# Altium project Outdoor_Tracking.PrjPcb (part 1 of 2)
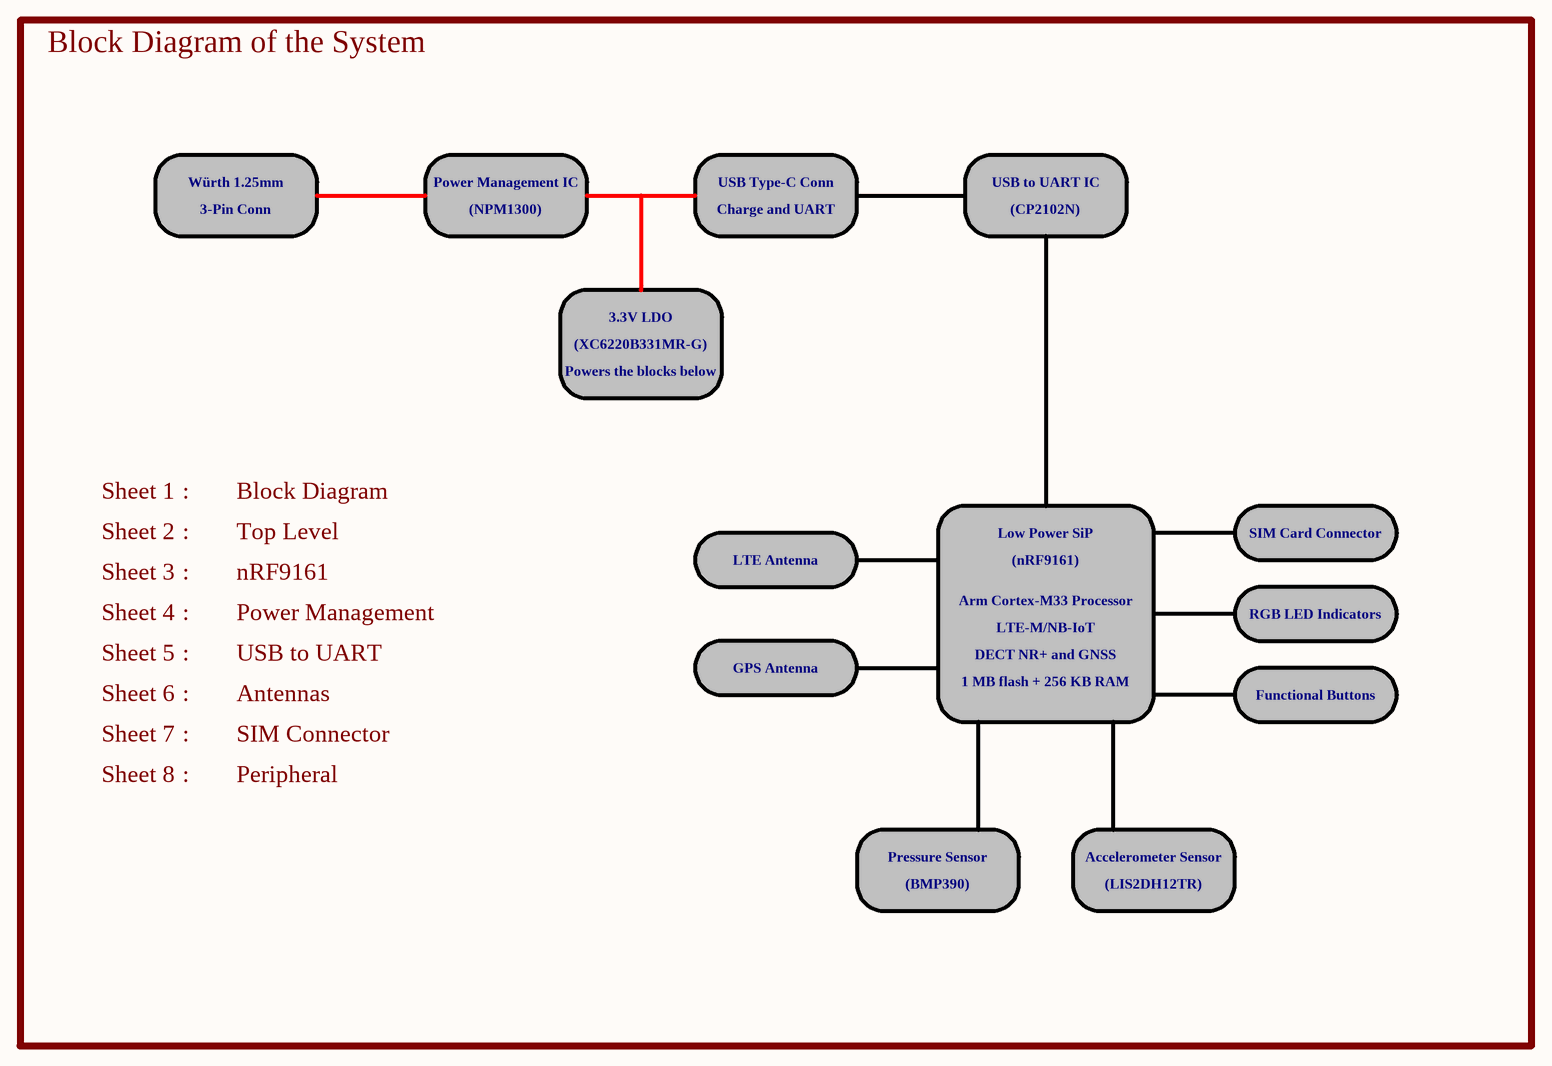
[diagram p0: Block Diagram.SchDoc]
8 sheets, 134 parts. Net scope: hierarchical (ports join the sheet entries above them; power ports are global).
Board file: Outdoor_Tracker_v1.0.PcbDoc
Sheets:
  Block Diagram.SchDoc
  MAIN.SchDoc
    U_nRF9161 = nRF9161.SchDoc
    U_Power_Management = Power_Management.SchDoc
    U_USB_to_UART = USB_to_UART.SchDoc
    U_Peripheral = Peripheral.SchDoc
    U_Antennas = Antennas.SchDoc
    U_SIM_Connector = SIM_Connector.SchDoc

## Sheet Block Diagram.SchDoc
size A3; ApprovedBy: Mustafa Atılay Beycan; CheckedBy: Mustafa Atılay Beycan; Author: Mustafa Atılay Beycan; CompanyName: Mustafa Atılay Beycan; DrawnBy: Mustafa Atılay Beycan; Engineer: Mustafa Atılay Beycan; Organization: Mustafa Atılay Beycan; SheetNumber: 1; SheetTotal: 8; FilePath: https://github.com/mustafaatilay/Outdoor-Tracking-Project

### Notes on the sheet
- Block Diagram of the System
- Würth 1.25mm
- 3-Pin Conn
- Power Management IC
- (NPM1300)
- USB Type-C Conn
- Charge and UART
- USB to UART IC
- (CP2102N)
- 3.3V LDO
- (XC6220B331MR-G)
- Powers the blocks below
- Sheet 1
- Sheet 2
- :
- Block Diagram
- Top Level
- Low Power SiP
- SIM Card Connector
- Sheet 3
- nRF9161
- LTE Antenna
- (nRF9161)
- Arm Cortex-M33 Processor
- RGB LED Indicators
- Sheet 4
- Sheet 5
- Power Management
- USB to UART
- GPS Antenna
- LTE-M/NB-IoT
- DECT NR+ and GNSS
- 1 MB flash + 256 KB RAM
- Sheet 6
- Sheet 7
- Antennas
- SIM Connector
- Functional Buttons
- Sheet 8
- Peripheral
- Pressure Sensor
- (BMP390)
- Accelerometer Sensor
- (LIS2DH12TR)
- Project Name
- Designed by
- Schematic Name
- Checked by
- Page Size
- File Path
- Modified Date
- Revision No
- Sheet
- of
- A3

## Sheet MAIN.SchDoc
size A3; ApprovedBy: Mustafa Atılay Beycan; CheckedBy: Mustafa Atılay Beycan; Author: Mustafa Atılay Beycan; CompanyName: Mustafa Atılay Beycan; DrawnBy: Mustafa Atılay Beycan; Engineer: Mustafa Atılay Beycan; Organization: Mustafa Atılay Beycan; SheetNumber: 2; SheetTotal: 8; FilePath: https://github.com/mustafaatilay/Outdoor-Tracking-Project
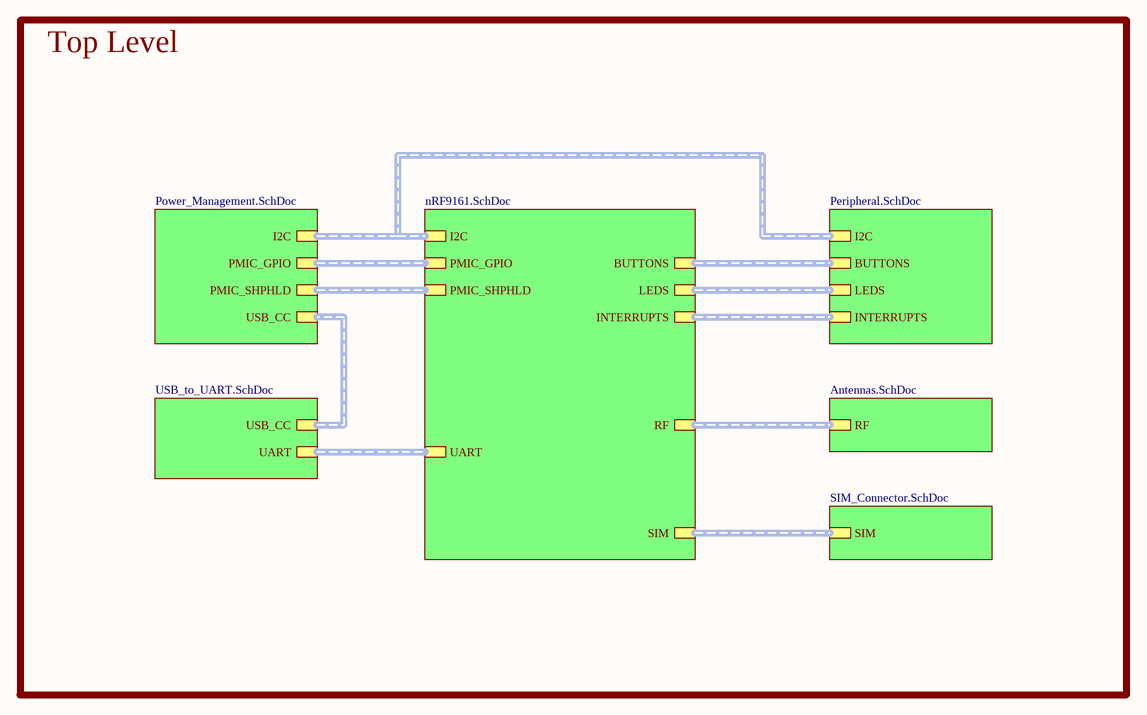
[diagram p1: MAIN.SchDoc]

### Sub-sheets
U_Antennas = Antennas.SchDoc: RF (harness RF)
U_nRF9161 = nRF9161.SchDoc: I2C (harness I2C), BUTTONS (harness BUTTONS), LEDS (harness LEDS), INTERRUPTS (harness INTERRUPTS), SIM (harness SIM), RF (harness RF), UART (harness UART), PMIC_GPIO (harness PMIC_GPIO), PMIC_SHPHLD (harness PMIC_SHPHLD)
U_Peripheral = Peripheral.SchDoc: I2C (harness I2C), BUTTONS (harness BUTTONS), LEDS (harness LEDS), INTERRUPTS (harness INTERRUPTS)
U_Power_Management = Power_Management.SchDoc: I2C (harness I2C), PMIC_GPIO (harness PMIC_GPIO), USB_CC (harness USB_CC), PMIC_SHPHLD (harness PMIC_SHPHLD)
U_SIM_Connector = SIM_Connector.SchDoc: SIM (harness SIM)
U_USB_to_UART = USB_to_UART.SchDoc: UART (harness UART), USB_CC (harness USB_CC)

### Buses and harness runs
harness sheet U_Antennas/RF = sheet U_nRF9161/RF
harness sheet U_nRF9161/BUTTONS = sheet U_Peripheral/BUTTONS
harness sheet U_nRF9161/I2C = sheet U_Peripheral/I2C = sheet U_Power_Management/I2C
harness sheet U_nRF9161/INTERRUPTS = sheet U_Peripheral/INTERRUPTS
harness sheet U_nRF9161/LEDS = sheet U_Peripheral/LEDS
harness sheet U_nRF9161/PMIC_GPIO = sheet U_Power_Management/PMIC_GPIO
harness sheet U_nRF9161/PMIC_SHPHLD = sheet U_Power_Management/PMIC_SHPHLD
harness sheet U_nRF9161/SIM = sheet U_SIM_Connector/SIM
harness sheet U_nRF9161/UART = sheet U_USB_to_UART/UART
harness sheet U_Power_Management/USB_CC = sheet U_USB_to_UART/USB_CC

### Notes on the sheet
- Top Level
- Project Name
- Designed by
- Schematic Name
- Checked by
- Page Size
- File Path
- Modified Date
- Revision No
- Sheet
- of
- A3

## Sheet nRF9161.SchDoc
size A3; ApprovedBy: Mustafa Atılay Beycan; CheckedBy: Mustafa Atılay Beycan; Author: Mustafa Atılay Beycan; CompanyName: Mustafa Atılay Beycan; DrawnBy: Mustafa Atılay Beycan; Engineer: Mustafa Atılay Beycan; Organization: Mustafa Atılay Beycan; SheetNumber: 3; SheetTotal: 8; FilePath: https://github.com/mustafaatilay/Outdoor-Tracking-Project
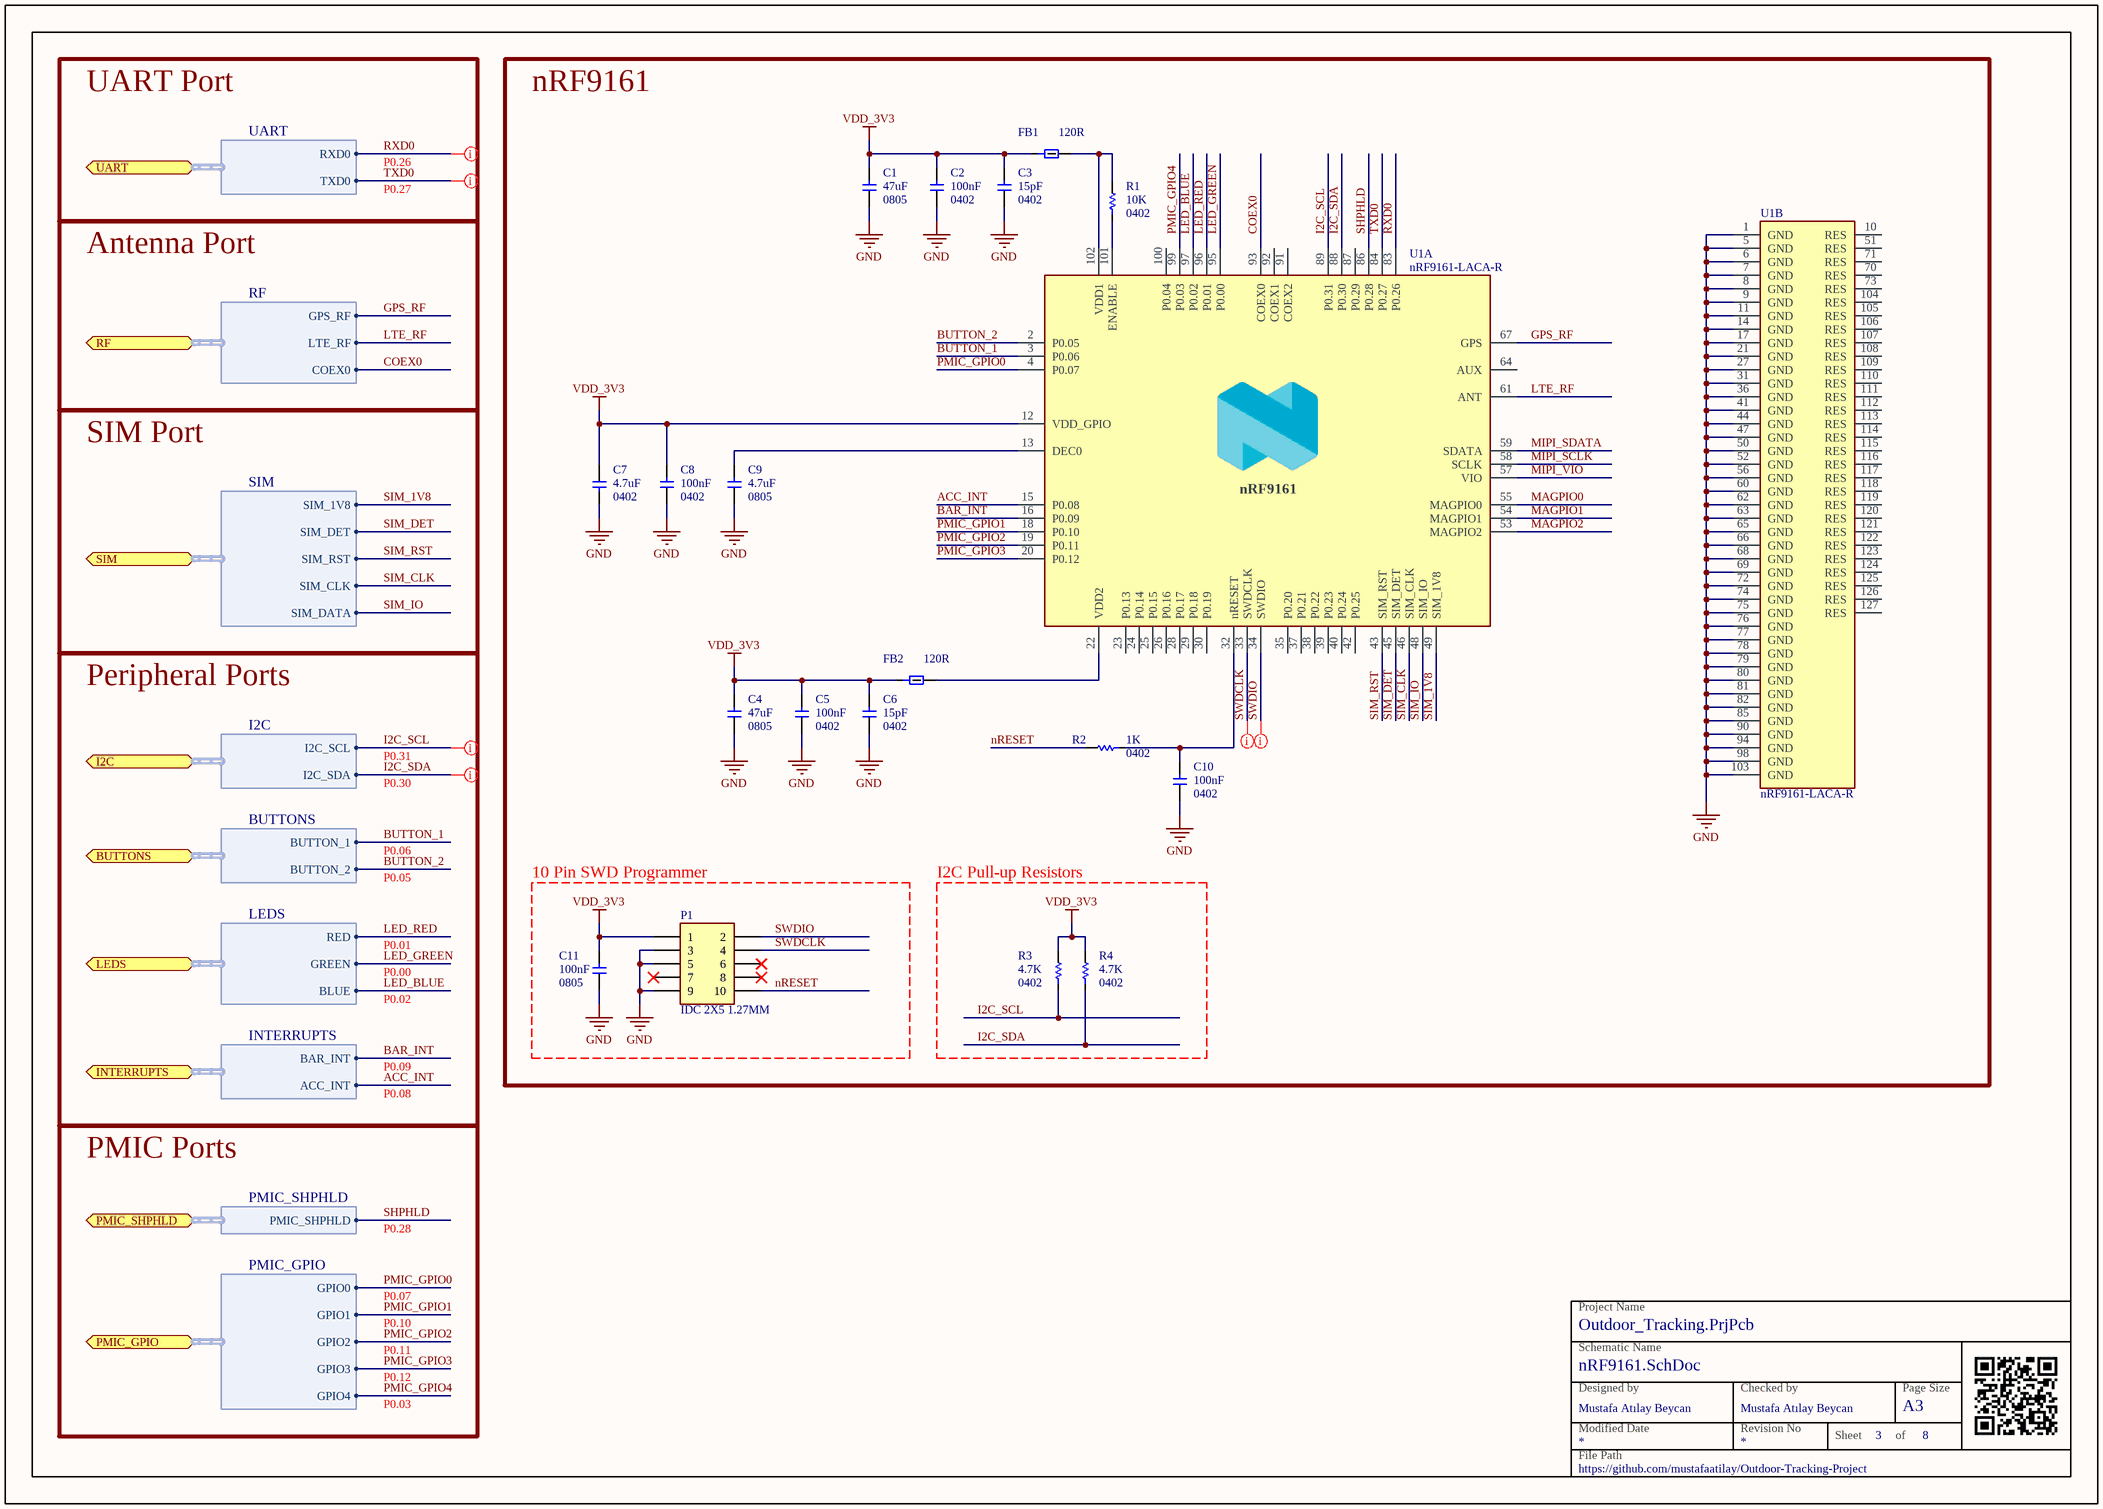
[diagram p2: nRF9161.SchDoc]

### Parts
C1  Capacitance: 47uF  Package: 0805  [CAP 0805]  (hidden comment: 47uF 10% X7R 10V 0805 SMD)
C2  Capacitance: 100nF  Package: 0402  [CAP 0402]  (hidden comment: 100nF 10% X7R 10V 0402 SMD)
C3  Capacitance: 15pF  Package: 0402  [CAP 0402]  (hidden comment: 15pF 10% X7R 16V 0402 SMD)
C4  Capacitance: 47uF  Package: 0805  [CAP 0805]  (hidden comment: 47uF 10% X7R 10V 0805 SMD)
C5  Capacitance: 100nF  Package: 0402  [CAP 0402]  (hidden comment: 100nF 10% X7R 10V 0402 SMD)
C6  Capacitance: 15pF  Package: 0402  [CAP 0402]  (hidden comment: 15pF 10% X7R 16V 0402 SMD)
C7  Capacitance: 4.7uF  Package: 0402  [CAP 0402]  (hidden comment: 4.7uF 10% X7R 10V 0402 SMD)
C8  Capacitance: 100nF  Package: 0402  [CAP 0402]  (hidden comment: 100nF 10% X7R 10V 0402 SMD)
C9  Capacitance: 4.7uF  Package: 0805  [CAP 0805]  (hidden comment: 4.7uF 10% X7R 10V 0805 SMD)
C10  Capacitance: 100nF  Package: 0402  [CAP 0402]  (hidden comment: 100nF 10% X7R 16V 0402 SMD)
C11  Capacitance: 100nF  Package: 0805  [CAP 0805]  (hidden comment: 100nF 10% X7R 16V 0805 SMD)
FB1  Impedance: 120R  [FERRITE 0402]  (hidden comment: BLM15AX121SN1D)
FB2  Impedance: 120R  [FERRITE 0402]  (hidden comment: BLM15AX121SN1D)
P1  IDC 2X5 1.27MM  [CONN 2x5 IDC 1.27MM]
R1  Resistance: 10K  Package: 0402  [RES 0402]  (hidden comment: 10K 1% 1/10W 0402 SMD)
R2  Resistance: 1K  Package: 0402  [RES 0402]  (hidden comment: 1K 5% 1/10W 0402 SMD)
R3  Resistance: 4.7K  Package: 0402  [RES 0402]  (hidden comment: 4.7K 5% 1/10W 0402 SMD)
R4  Resistance: 4.7K  Package: 0402  [RES 0402]  (hidden comment: 4.7K 5% 1/10W 0402 SMD)
U1  nRF9161-LACA-R  [IC nRF9161]  (parts A,B of 2)

### Blocks framed on the sheet
nRF9161: C1-C10 FB1 FB2 R1 R2 U1
10 Pin SWD Programmer: C11 P1
I2C Pull-up Resistors: R3 R4

### Ports
BUTTONS (bidir, harness BUTTONS), I2C (bidir, harness I2C), INTERRUPTS (bidir, harness INTERRUPTS), LEDS (bidir, harness LEDS), PMIC_GPIO (bidir, harness PMIC_GPIO), PMIC_SHPHLD (bidir, harness PMIC_SHPHLD), RF (bidir, harness RF), SIM (bidir, harness SIM), UART (bidir, harness UART)

### Harnesses
PMIC_GPIO: GPIO0, GPIO1, GPIO2, GPIO3, GPIO4
PMIC_SHPHLD: PMIC_SHPHLD
I2C: I2C_SCL, I2C_SDA
BUTTONS: BUTTON_1, BUTTON_2
LEDS: RED, GREEN, BLUE
INTERRUPTS: BAR_INT, ACC_INT
SIM: SIM_1V8, SIM_DET, SIM_RST, SIM_CLK, SIM_DATA
RF: GPS_RF, LTE_RF, COEX0
UART: RXD0, TXD0

### Nets
GND: C1.2 C2.2 C3.2 C4.2 C5.2 C6.2 C7.1 C8.2 C9.2 C10.2 C11.2 P1.3 P1.5 P1.9 U1.1(GND) U1.5(GND) U1.6(GND) U1.7(GND) U1.8(GND) U1.9(GND) U1.11(GND) U1.14(GND) U1.17(GND) U1.21(GND) U1.27(GND) U1.31(GND) U1.36(GND) U1.41(GND) U1.44(GND) U1.47(GND) U1.50(GND) U1.52(GND) U1.56(GND) U1.60(GND) U1.62(GND) U1.63(GND) U1.65(GND) U1.66(GND) U1.68(GND) U1.69(GND) U1.72(GND) U1.74(GND) U1.75(GND) U1.76(GND) U1.77(GND) U1.78(GND) U1.79(GND) U1.80(GND) U1.81(GND) U1.82(GND) U1.85(GND) U1.90(GND) U1.94(GND) U1.98(GND) U1.103(GND)
VDD_3V3: C1.1 C2.1 C3.1 C4.1 C5.1 C6.1 C7.2 C8.1 C11.1 FB1.1 FB2.1 P1.1 R3.2 R4.2 U1.12(VDD_GPIO)
ACC_INT: U1.15(P0.08) ; port INTERRUPTS.ACC_INT
BAR_INT: U1.16(P0.09) ; port INTERRUPTS.BAR_INT
BUTTON_1: U1.3(P0.06) ; port BUTTONS.BUTTON_1
BUTTON_2: U1.2(P0.05) ; port BUTTONS.BUTTON_2
COEX0: U1.93(COEX0) ; port RF.COEX0
GPS_RF: U1.67(GPS) ; port RF.GPS_RF
I2C_SCL: R3.1 U1.89(P0.31) ; port I2C.I2C_SCL
I2C_SDA: R4.1 U1.88(P0.30) ; port I2C.I2C_SDA
LED_BLUE: U1.97(P0.02) ; port LEDS.BLUE
LED_GREEN: U1.95(P0.00) ; port LEDS.GREEN
LED_RED: U1.96(P0.01) ; port LEDS.RED
LTE_RF: U1.61(ANT) ; port RF.LTE_RF
MAGPIO0: U1.55(MAGPIO0)
MAGPIO1: U1.54(MAGPIO1)
MAGPIO2: U1.53(MAGPIO2)
MIPI_SCLK: U1.58(SCLK)
MIPI_SDATA: U1.59(SDATA)
MIPI_VIO: U1.57(VIO)
nRESET: P1.10 R2.2
PMIC_GPIO0: U1.4(P0.07) ; port PMIC_GPIO.GPIO0
PMIC_GPIO1: U1.18(P0.10) ; port PMIC_GPIO.GPIO1
PMIC_GPIO2: U1.19(P0.11) ; port PMIC_GPIO.GPIO2
PMIC_GPIO3: U1.20(P0.12) ; port PMIC_GPIO.GPIO3
PMIC_GPIO4: U1.99(P0.03) ; port PMIC_GPIO.GPIO4
RXD0: U1.83(P0.26) ; port UART.RXD0
SHPHLD: U1.86(P0.28) ; port PMIC_SHPHLD.PMIC_SHPHLD
SIM_1V8: U1.49(SIM_1V8) ; port SIM.SIM_1V8
SIM_CLK: U1.46(SIM_CLK) ; port SIM.SIM_CLK
SIM_DET: U1.45(SIM_DET) ; port SIM.SIM_DET
SIM_IO: U1.48(SIM_IO) ; port SIM.SIM_DATA
SIM_RST: U1.43(SIM_RST) ; port SIM.SIM_RST
SWDCLK: P1.4 U1.33(SWDCLK)
SWDIO: P1.2 U1.34(SWDIO)
TXD0: U1.84(P0.27) ; port UART.TXD0
NetC9_1: C9.1 U1.13(DEC0)
NetC10_1: C10.1 R2.1 U1.32(nRESET)
NetFB1_2: FB1.2 R1.2 U1.102(VDD1)
NetFB2_2: FB2.2 U1.22(VDD2)
NetR1_1: R1.1 U1.101(ENABLE)

Not connected (* = marked no-connect by the designer): P1 6* 7* 8*; U1 10(RES) 23(P0.13) 24(P0.14) 25(P0.15) 26(P0.16) 28(P0.17) 29(P0.18) 30(P0.19) 35(P0.20) 37(P0.21) 38(P0.22) 39(P0.23) 40(P0.24) 42(P0.25) 51(RES) 64(AUX) 70(RES) 71(RES) 73(RES) 87(P0.29) 91(COEX2) 92(COEX1) 100(P0.04) 104(RES) 105(RES) 106(RES) 107(RES) 108(RES) 109(RES) 110(RES) 111(RES) 112(RES) 113(RES) 114(RES) 115(RES) 116(RES) 117(RES) 118(RES) 119(RES) 120(RES) 121(RES) 122(RES) 123(RES) 124(RES) 125(RES) 126(RES) 127(RES)

### Layout directives
net class SWD: SWDCLK, SWDIO
net class UART: RXD0, TXD0
net class I2C: I2C_SCL, I2C_SDA

### Notes on the sheet
- UART Port
- P0.26
- P0.27
- Antenna Port
- SIM Port
- Peripheral Ports
- P0.30
- P0.31
- P0.06
- P0.05
- P0.00
- P0.01
- P0.02
- P0.09
- P0.08
- PMIC Ports
- P0.28
- P0.07
- P0.10
- P0.03
- P0.11
- P0.12
- Project Name
- Designed by
- Schematic Name
- Checked by
- Page Size
- File Path
- Modified Date
- Revision No
- Sheet
- of
- A3
- (in symbol IC nRF9161-LACA-R, part A) nRF9161

### Library data of the parts
C1 C4 = CAP 0805 47uF 10V: ALT MALZEME KODU: 1.009.00956; Link: *; Manufacturer: *; Manufacturer Part Number: *; Value: 47uF 10% X7R 10V 0805 SMD; Tolerance: 10%; TemperatureCoefficient: X7R; Mount: SMD; Voltage: 10V
C2 C5 C8 = CAP 0402 100nF 10V: ALT MALZEME KODU: 1.009.00840; Link: *; Manufacturer: *; Manufacturer Part Number: *; Value: 100nF 10% X7R 10V 0402 SMD; Tolerance: 10%; TemperatureCoefficient: X7R; Mount: SMD; Voltage: 10V
C3 C6 = CAP 0402 15pF 16V: ALT MALZEME KODU: 1.009.00947; Link: *; Manufacturer: *; Manufacturer Part Number: *; Value: 15pF 10% X7R 16V 0402 SMD; Tolerance: 10%; TemperatureCoefficient: X7R; Mount: SMD; Voltage: 16V
C7 = CAP 0402 4.7uF 10V: ALT MALZEME KODU: 1.009.00987; Link: *; Manufacturer: *; Manufacturer Part Number: *; Value: 4.7uF 10% X7R 10V 0402 SMD; Tolerance: 10%; TemperatureCoefficient: X7R; Mount: SMD; Voltage: 10V
C9 = CAP 0805 4.7uF 10V: ALT MALZEME KODU: 1.009.00882; Link: *; Manufacturer: *; Manufacturer Part Number: *; Value: 4.7uF 10% X7R 10V 0805 SMD; Tolerance: 10%; TemperatureCoefficient: X7R; Mount: SMD; Voltage: 10V
C10 = CAP 0402 100nF 16V: ALT MALZEME KODU: 1.009.00275; Link: *; Manufacturer: *; Manufacturer Part Number: *; Value: 100nF 10% X7R 16V 0402 SMD; Tolerance: 10%; TemperatureCoefficient: X7R; Mount: SMD; Voltage: 16V
C11 = CAP 0805 100nF 16V: ALT MALZEME KODU: 1.009.00953; Link: *; Manufacturer: *; Manufacturer Part Number: *; Value: 100nF 10% X7R 16V 0805 SMD; Tolerance: 10%; TemperatureCoefficient: X7R; Mount: SMD; Voltage: 16V
FB1 FB2 = FER BLM15AX121SN1D: FERRITE BEAD 120 OHM 0402 1LN; Manufacturer: Murata; Material: Steel; Core Material: 228ConductorMaterial; Tolerance: 25%; Current Rating: 700mA; Number of Lines: 1; DC Resistance (DCR): 130mR; Test Frequency: 100MHz; ComponentLink1URL: https://datasheet.ciiva.com/18183/getdatasheetpartid-238207-18183177.pdf?src-supplier=Verical; ComponentLink1Description: https://datasheet.ciiva.com/18183/getdatasheetpartid-238207-18183177.pdf?src-supplier=Verical; ComponentLink2URL: https://datasheet.ciiva.com/41449/001172204-da-01-en-drossel-0402-600r-1-0x0-5mm-10000st-41449492.pdf?src-supplier=Conrad; ComponentLink2Description: https://datasheet.ciiva.com/41449/001172204-da-01-en-drossel-0402-600r-1-0x0-5mm-10000st-41449492.pdf?src-supplier=Conrad; ComponentLink3URL: https://datasheet.ciiva.com/41425/001171685-da-01-en-chip-drossel0402-600r-300ma-1-0x0-5mm-41425771.pdf?src-supplier=Conrad; ComponentLink3Description: https://datasheet.ciiva.com/41425/001171685-da-01-en-chip-drossel0402-600r-300ma-1-0x0-5mm-41425771.pdf?src-supplier=Conrad; ComponentLink4URL: https://datasheet.ciiva.com/1014/l0110s0101blm15h-1014466.pdf?src-supplier=Digi-Key; ComponentLink4Description: https://datasheet.ciiva.com/1014/l0110s0101blm15h-1014466.pdf?src-supplier=Digi-Key; ComponentLink5URL: https://datasheet.ciiva.com/1014/l0110s0101blm15h-1014467.pdf?src-supplier=Digi-Key; ComponentLink5Description: https://datasheet.ciiva.com/1014/l0110s0101blm15h-1014467.pdf?src-supplier=Digi-Key; ComponentLink6URL: https://datasheet.ciiva.com/1466/5168-1466917.pdf?src-supplier=Element14; ComponentLink6Description: https://datasheet.ciiva.com/1466/5168-1466917.pdf?src-supplier=Element14; ComponentLink7URL: https://datasheet.ciiva.com/1466/5168-1466918.pdf?src-supplier=Element14; ComponentLink7Description: https://datasheet.ciiva.com/1466/5168-1466918.pdf?src-supplier=Element14; ComponentLink8URL: https://datasheet.ciiva.com/3081/l0110s0101blm15h-3081608.pdf?src-supplier=Avnet; ComponentLink8Description: https://datasheet.ciiva.com/3081/l0110s0101blm15h-3081608.pdf?src-supplier=Avnet; ComponentLink9URL: https://datasheet.ciiva.com/6212/l0110s0101blm15h-6212328.pdf?src-supplier=Digi-Key; ComponentLink9Description: https://datasheet.ciiva.com/6212/l0110s0101blm15h-6212328.pdf?src-supplier=Digi-Key; ComponentLink10URL: https://datasheet.ciiva.com/16204/l0110s0101blm15h-16204027.pdf?src-supplier=Future+Electronics; ComponentLink10Description: https://datasheet.ciiva.com/16204/l0110s0101blm15h-16204027.pdf?src-supplier=Future+Electronics; Link: https://bit.ly/3wIr28H; ALT MALZEME KODU: *; Supplier 1: Mouser; Manufacturer Part Number: BLM15AX121SN1D; RoHS: Yes; Category: Ferrite Beads and Chips; Stock 1: 30042; Pricing 1: 1=0,1, 10=0,051, 50=0,051, 100=0,028, 1000=0,022, 10000=0,015 (USD); Case/Package: 0402; Number of Pins: 2; Case Code (Metric): 1005; Case Code (Imperial): 0402; Weight: 2.3E-05oz; Min Operating Temperature: -55°C; Max Operating Temperature: 125°C; Package Quantity: 1; Packaging: Tape and Reel; Max Current Rating: 700mA; Termination: SMD/SMT; Max DC Current: 700mA; Number of Circuits: 1; Series: BLM15AX_SN; RMS Current (Irms): 700mA; Series Resistance: 130mR; Length: 1mm; Width: 0.5mm; Height: 0.5mm; Reach SVHC Compliant: No; Lead Free: Lead Free; RoHS Compliant: Yes; ComponentLink11URL: https://datasheet.ciiva.com/41449/001172167-da-01-en-drossel-0402-120r-1-0x0-5mm-10000st-41449456.pdf?src-supplier=Conrad; ComponentLink11Description: https://datasheet.ciiva.com/41449/001172167-da-01-en-drossel-0402-120r-1-0x0-5mm-10000st-41449456.pdf?src-supplier=Conrad; ComponentLink12URL: https://datasheet.ciiva.com/1012/l0110e-1012387.pdf?src-supplier=Digikey; ComponentLink12Description: https://datasheet.ciiva.com/1012/l0110e-1012387.pdf?src-supplier=Digikey; ComponentLink13URL: https://datasheet.ciiva.com/1012/l0110e-1012386.pdf?src-supplier=Digikey; ComponentLink13Description: https://datasheet.ciiva.com/1012/l0110e-1012386.pdf?src-supplier=Digikey; ComponentLink14URL: https://datasheet.ciiva.com/1012/l0110e-1012388.pdf?src-supplier=Digikey; ComponentLink14Description: https://datasheet.ciiva.com/1012/l0110e-1012388.pdf?src-supplier=Digikey; Supplier Part Number 1: 81-BLM15AX121SN1D
P1 = HEADER 2 X 5 IDC: CONN HEADER 2 X 5 1.27MM; LatestRevisionDate: 17-Jul-2002; LatestRevisionNote: Re-released for DXP Platform.; Publisher: Altium Limited
R1 = RES 0402 10K 1%: ALT MALZEME KODU: 1.031.00963; Link: *; Manufacturer: *; Manufacturer Part Number: *; Value: 10K 1% 1/10W 0402 SMD; Tolerance: 1%; PowerRating: 1/10W; Mount: SMD
R2 = RES 0402 1K 5%: ALT MALZEME KODU: 1.031.00622; Link: *; Manufacturer: *; Manufacturer Part Number: *; Value: 1K 5% 1/10W 0402 SMD; PowerRating: 1/10W; Mount: SMD; Tolerance: 5%
R3 R4 = RES 0402 4.7K 5%: ALT MALZEME KODU: 1.031.00627; Link: *; Manufacturer: *; Manufacturer Part Number: *; Value: 4.7K 5% 1/10W 0402 SMD; PowerRating: 1/10W; Mount: SMD; Tolerance: 5%
U1 = IC nRF9161-LACA-R: Manufacturer: Nordic Semiconductor ASA; Voltage - Supply: 3V ~ 5.5V; GPIO: 32; Serial Interfaces: I2C, I2S, PWM, SPI, UART; Memory Size: 1MB Flash, 256kB RAM; Sensitivity: -108dBm; Power - Output: 23dBm; Data Rate (Max): 8Mbps; Frequency: 600MHz ~ 2.2GHz; Protocol: GPS; RF Family/Standard: Cellular; Link 2: https://bit.ly/4aFKUH8; Link: https://bit.ly/3X10dqO; Type: TxRx Only; Manufacturer Product Number: NRF9161-LACA-R; Series: NRF9161

## Sheet Power_Management.SchDoc
size A3; ApprovedBy: Mustafa Atılay Beycan; CheckedBy: Mustafa Atılay Beycan; Author: Mustafa Atılay Beycan; CompanyName: Mustafa Atılay Beycan; DrawnBy: Mustafa Atılay Beycan; Engineer: Mustafa Atılay Beycan; Organization: Mustafa Atılay Beycan; SheetNumber: 4; SheetTotal: 8; FilePath: https://github.com/mustafaatilay/Outdoor-Tracking-Project
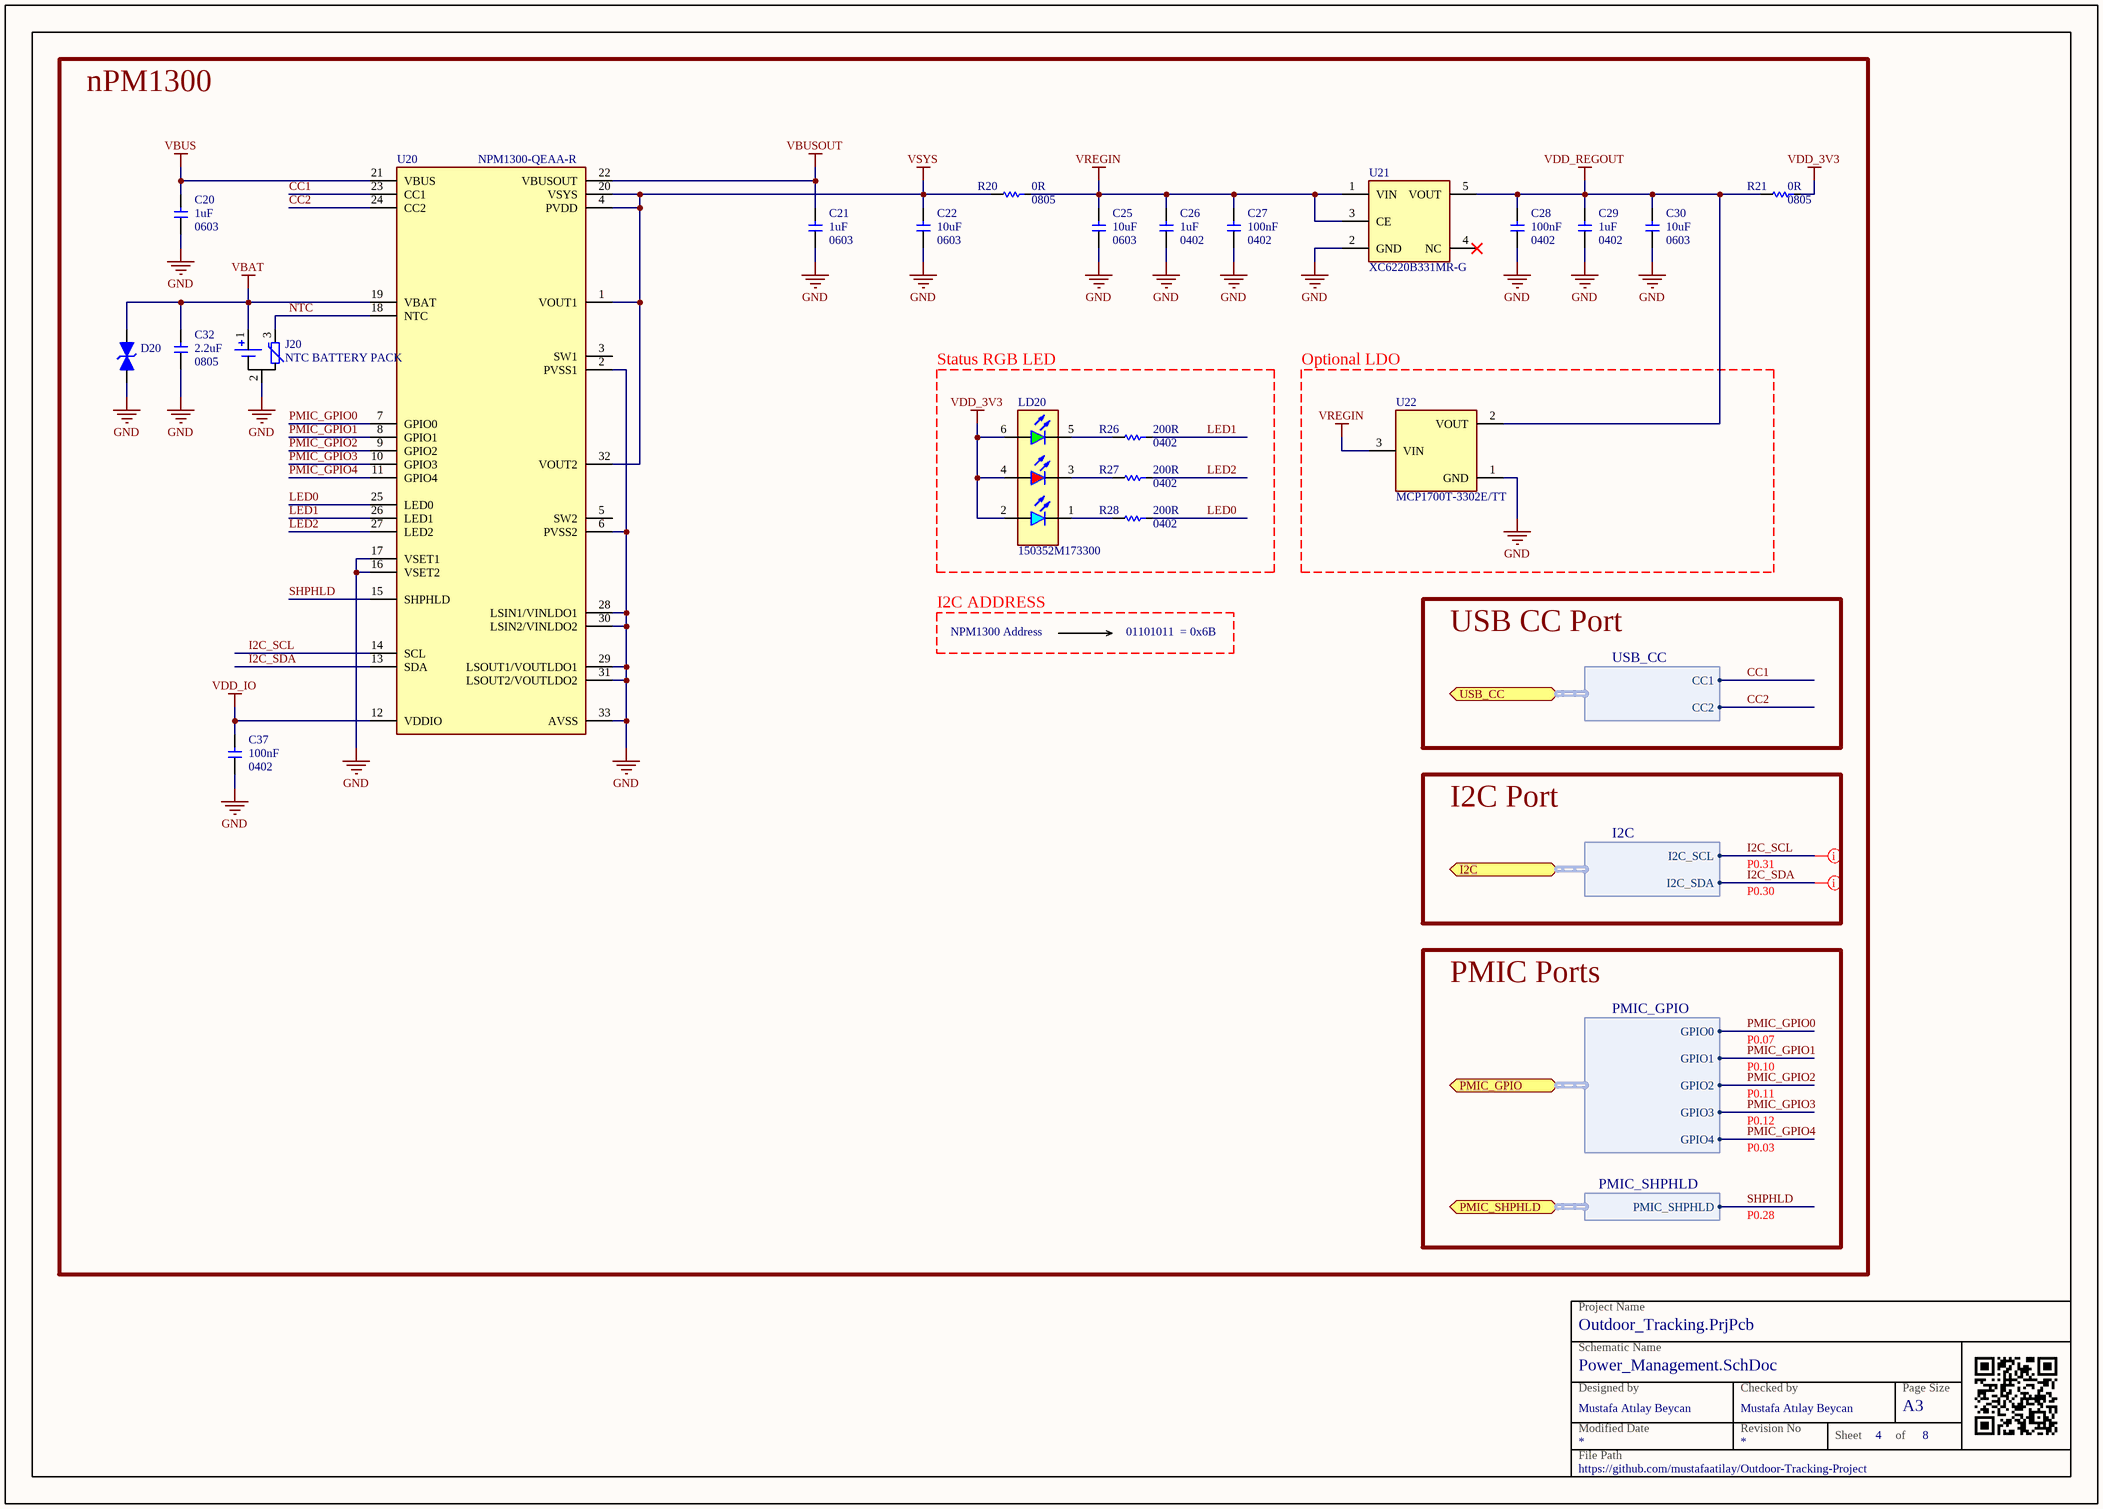
[diagram p3: Power_Management.SchDoc]

### Parts
C20  Capacitance: 1uF  Package: 0603  [CAP 0603]  (hidden comment: 1uF 10% X7R 16V 0603 SMD)
C21  Capacitance: 1uF  Package: 0603  [CAP 0603]  (hidden comment: 1uF 10% X7R 16V 0603 SMD)
C22  Capacitance: 10uF  Package: 0603  [CAP 0603]  (hidden comment: 10uF 20% X5R 25V 0603 SMD)
C25  Capacitance: 10uF  Package: 0603  [CAP 0603]  (hidden comment: 10uF 20% X5R 25V 0603 SMD)
C26  Capacitance: 1uF  Package: 0402  [CAP 0402]  (hidden comment: 1uF 10% X7R 10V 0402 SMD)
C27  Capacitance: 100nF  Package: 0402  [CAP 0402]  (hidden comment: 100nF 10% X7R 10V 0402 SMD)
C28  Capacitance: 100nF  Package: 0402  [CAP 0402]  (hidden comment: 100nF 10% X7R 10V 0402 SMD)
C29  Capacitance: 1uF  Package: 0402  [CAP 0402]  (hidden comment: 1uF 10% X7R 10V 0402 SMD)
C30  Capacitance: 10uF  Package: 0603  [CAP 0603]  (hidden comment: 10uF 20% X5R 25V 0603 SMD)
C32  Capacitance: 2.2uF  Package: 0805  [CAP 0805]  (hidden comment: 2.2uF 10% X7T 100V 0805 SMD)
C37  Capacitance: 100nF  Package: 0402  [CAP 0402]  (hidden comment: 100nF 10% X7R 16V 0402 SMD)
D20  D5V0L1B2WS-7  [DIODE TVS SOD-323]  (value not drawn)
J20  NTC BATTERY PACK  [CONN BATT - 1.25MM 3 PIN]
LD20  150352M173300  [LED RGB 150352M173300]
R20  Resistance: 0R  Package: 0805  [RES 0805]  (hidden comment: 0R 5% * 0805 SMD)
R21  Resistance: 0R  Package: 0805  [RES 0805]  (hidden comment: 0R 5% * 0805 SMD)
R26  Resistance: 200R  Package: 0402  [RES 0402]  (hidden comment: 200R 5% 1/10W 0402 SMD)
R27  Resistance: 200R  Package: 0402  [RES 0402]  (hidden comment: 200R 5% 1/10W 0402 SMD)
R28  Resistance: 200R  Package: 0402  [RES 0402]  (hidden comment: 200R 5% 1/10W 0402 SMD)
U20  NPM1300-QEAA-R  [IC QFN-32 (5X5) EXP]
U21  XC6220B331MR-G  [IC SOT-25]
U22  MCP1700T-3302E/TT  [IC SOT-23-3]

### Blocks framed on the sheet
Status RGB LED: LD20 R26-R28
Optional LDO: U22

### Ports
I2C (bidir, harness I2C), PMIC_GPIO (bidir, harness PMIC_GPIO), PMIC_SHPHLD (bidir, harness PMIC_SHPHLD), USB_CC (bidir, harness USB_CC)

### Harnesses
I2C: I2C_SCL, I2C_SDA
PMIC_GPIO: GPIO0, GPIO1, GPIO2, GPIO3, GPIO4
USB_CC: CC1, CC2
PMIC_SHPHLD: PMIC_SHPHLD

### Nets
GND: C20.2 C21.2 C22.2 C25.2 C26.2 C27.2 C28.2 C29.2 C30.2 C32.2 C37.2 D20.1 J20.2 U20.2(PVSS1) U20.6(PVSS2) U20.16(VSET2) U20.17(VSET1) U20.28(LSIN1/VINLDO1) U20.29(LSOUT1/VOUTLDO1) U20.30(LSIN2/VINLDO2) U20.31(LSOUT2/VOUTLDO2) U20.33(AVSS) U21.2(GND) U22.1(GND)
VBAT: C32.1 D20.2 J20.1 U20.19(VBAT)
VBUS: C20.1 U20.21(VBUS)
VBUSOUT: C21.1 U20.22(VBUSOUT)
VDD_3V3: LD20.2(A) LD20.4(A) LD20.6(A) R21.1
VDD_IO: C37.1 U20.12(VDDIO)
VDD_REGOUT: C28.1 C29.1 C30.1 R21.2 U21.5(VOUT) U22.2(VOUT)
VREGIN: C25.1 C26.1 C27.1 R20.1 U21.1(VIN) U21.3(CE) U22.3(VIN)
VSYS: C22.1 R20.2 U20.1(VOUT1) U20.4(PVDD) U20.20(VSYS) U20.32(VOUT2)
CC1: U20.23(CC1) ; port USB_CC.CC1
CC2: U20.24(CC2) ; port USB_CC.CC2
I2C_SCL: U20.14(SCL) ; port I2C.I2C_SCL
I2C_SDA: U20.13(SDA) ; port I2C.I2C_SDA
LED0: R28.1 U20.25(LED0)
LED1: R26.1 U20.26(LED1)
LED2: R27.1 U20.27(LED2)
NTC: J20.3 U20.18(NTC)
PMIC_GPIO0: U20.7(GPIO0) ; port PMIC_GPIO.GPIO0
PMIC_GPIO1: U20.8(GPIO1) ; port PMIC_GPIO.GPIO1
PMIC_GPIO2: U20.9(GPIO2) ; port PMIC_GPIO.GPIO2
PMIC_GPIO3: U20.10(GPIO3) ; port PMIC_GPIO.GPIO3
PMIC_GPIO4: U20.11(GPIO4) ; port PMIC_GPIO.GPIO4
SHPHLD: U20.15(SHPHLD) ; port PMIC_SHPHLD.PMIC_SHPHLD
NetLD20_1: LD20.1(K) R28.2
NetLD20_3: LD20.3(K) R27.2
NetLD20_5: LD20.5(K) R26.2

Not connected (* = marked no-connect by the designer): U20 3(SW1) 5(SW2); U21 4(NC)*

### Layout directives
net class I2C: I2C_SCL, I2C_SDA

### Notes on the sheet
- nPM1300
- I2C ADDRESS
- NPM1300 Address
- 01101011  = 0x6B
- USB CC Port
- I2C Port
- P0.31
- P0.30
- PMIC Ports
- P0.07
- P0.10
- P0.11
- P0.12
- P0.03
- P0.28
- Project Name
- Designed by
- Schematic Name
- Checked by
- Page Size
- File Path
- Modified Date
- Revision No
- Sheet
- of
- A3

### Library data of the parts
C20 C21 = CAP 0603 1uF 16V: ALT MALZEME KODU: 1.009.00271; Link: *; Manufacturer: *; Manufacturer Part Number: *; Value: 1uF 10% X7R 16V 0603 SMD; Tolerance: 10%; TemperatureCoefficient: X7R; Mount: SMD; Voltage: 16V
C22 C25 C30 = CAP 0603: CAP 0603 10uF 25V 20%; Link: *; Manufacturer: *; Manufacturer Part Number: *; Value: CAP 0603; Tolerance: 20%; TemperatureCoefficient: X5R; Mount: SMD; ALT MALZEME KODU: *; Voltage: 25V
C26 C29 = CAP 0402 1uF 10V: ALT MALZEME KODU: 1.009.00838; Link: *; Manufacturer: *; Manufacturer Part Number: *; Value: 1uF 10% X7R 10V 0402 SMD; Tolerance: 10%; TemperatureCoefficient: X7R; Mount: SMD; Voltage: 10V
C27 C28 = CAP 0402 100nF 10V: ALT MALZEME KODU: 1.009.00840; Link: *; Manufacturer: *; Manufacturer Part Number: *; Value: 100nF 10% X7R 10V 0402 SMD; Tolerance: 10%; TemperatureCoefficient: X7R; Mount: SMD; Voltage: 10V
C32 = CAP 0805 2.2uF 100V: Manufacturer: Murata Electronics; Manufacturer Part Number: GRT21BD72A225KE13K; Link: https://bit.ly/3Ly0hbg; Value: 2.2uF 10% X7T 100V 0805 SMD; Tolerance: 10%; TemperatureCoefficient: X7T; Mount: SMD; ALT MALZEME KODU: *; Voltage: 100V
C37 = CAP 0402 100nF 16V: ALT MALZEME KODU: 1.009.00275; Link: *; Manufacturer: *; Manufacturer Part Number: *; Value: 100nF 10% X7R 16V 0402 SMD; Tolerance: 10%; TemperatureCoefficient: X7R; Mount: SMD; Voltage: 16V
D20 = TVS D5V0L1B2WS-7: TVS DIODE 5V 14V SOD323; Manufacturer: Diodes Incorporated; Voltage - Reverse Standoff: 5V (Max); Voltage - Clamping: 14V (Max); Current - Peak Pulse: 6A (8/20µs); Power - Peak Pulse: 84W; Capacitance: 15pF @ 1MHz; ALT MALZEME KODU: 1.012.01100; Link: https://bit.ly/3mhJc7p; Manufacturer Part Number: D5V0L1B2WS-7; Mount: SMD; Package: SOD-323
J20 = BATT NTC: 653003117322; Manufacturer: Würth Electronic; Manufacturer Part Number: 653003117322
LD20 = LED RGB 150352M173300: LED RGB CLEAR 6PLCC SMD; Manufacturer: Würth Elektronik; Voltage - Forward (Vf) (Typ): 2V Red, 3.2V Green, 3.2V Blue; Lens Color: Colorless; Color: Red, Green, Blue (RGB); Configuration: Independent; Manufacturer Product Number: 150352M173300; Link: https://bit.ly/4dLumjj
R20 R21 = RES 0805 0R 5%: ALT MALZEME KODU: 1.031.00613; Link: *; Manufacturer: *; Manufacturer Part Number: *; Value: 0R 5% * 0805 SMD; Tolerance: 5%; PowerRating: *; Mount: SMD
R26-R28 = RES 0402 200R 5%: ALT MALZEME KODU: 1.031.00643; Link: *; Manufacturer: *; Manufacturer Part Number: *; Value: 200R 5% 1/10W 0402 SMD; PowerRating: 1/10W; Mount: SMD; Tolerance: 5%
U20 = IC NPM1300-QEAA-R: PMIC (POWER MANAGEMENT IC); Manufacturer: Nordic Semiconductor ASA; Battery Chemistry: Lithium Ion/Polymer; Number of Cells: 1; Fault Protection: Over Current, Over Temperature, Over/Under Voltage; Interface: GPIO, I2C; Link: https://bit.ly/47b68fX; Manufacturer Product Number: NPM1300-QEAA-R; Function: Power Management
U21 = IC XC6220B331MR-G: IC REG LINEAR 3.3V 1A SOT-25; Manufacturer: Torex; Dropout Voltage: 655mV; Min Input Voltage: 1.6V; Max Input Voltage: 6V; Number of Regulators: 1; Min Current Limit: 1.005A; Output Type: Fixed; ALT MALZEME KODU: 1.029.00604; Supplier 1: Digi-Key; Manufacturer Part Number: XC6220B331MR-G; RoHS: Yes; Category: Voltage Regulators - Linear; Stock 1: 41723; Pricing 1: 1=0,96000, 10=0,86000, 25=0,81600, 100=0,67040, 250=0,62672, 500=0,55384, 1000=0,43725 (USD); Mount: Surface Mount; Case/Package: SOT-25; Number of Pins: 5; Min Operating Temperature: -40°C; Max Operating Temperature: 85°C; Package Quantity: 1; Packaging: Tape and Reel; Output Current: 1A; Output Voltage: 3.3V; Nominal Output Voltage: 3.3V; Series: -; REACH SVHC: No SVHC; RoHS Compliant: Yes; ComponentLink1URL: https://datasheet.ciiva.com/7992/610888-7992813.pdf?src-supplier=Element14; ComponentLink1Description: https://datasheet.ciiva.com/7992/610888-7992813.pdf?src-supplier=Element14; ComponentLink2URL: https://datasheet.ciiva.com/5755/610888-5755886.pdf?src-supplier=Farnell; ComponentLink2Description: https://datasheet.ciiva.com/5755/610888-5755886.pdf?src-supplier=Farnell; ComponentLink3URL: https://datasheet.ciiva.com/2040/xc6220-2040201.pdf?src-supplier=Digi-Key; ComponentLink3Description: https://datasheet.ciiva.com/2040/xc6220-2040201.pdf?src-supplier=Digi-Key; ComponentLink4URL: https://datasheet.ciiva.com/2040/xc6220-2040200.pdf?src-supplier=Digi-Key; ComponentLink4Description: https://datasheet.ciiva.com/2040/xc6220-2040200.pdf?src-supplier=Digi-Key; ComponentLink5URL: https://datasheet.ciiva.com/2040/xc6220-2040202.pdf?src-supplier=Digi-Key; ComponentLink5Description: https://datasheet.ciiva.com/2040/xc6220-2040202.pdf?src-supplier=Digi-Key; Supplier Part Number 1: 893-1133-1-ND; Link: https://bit.ly/3DS6BXY
U22 = IC MCP1700T-3302E/TT: IC REG LINEAR 3.3V 250MA SOT23-3; Manufacturer: Microchip Technology; Voltage - Input: 6V (Max); Voltage - Output: 3.3V Fixed; Voltage Dropout: 0.35V @ 250mA; PSRR: 44dB (100Hz); ALT MALZEME KODU: 1.029.00603; Manufacturer Part Number: MCP1700T-3302E/TT; Link: https://bit.ly/3bVx1Ze; Current - Output: 250mA; Package: SOT-23-3; Mount: SMD

## Sheet USB_to_UART.SchDoc
size A3; ApprovedBy: Mustafa Atılay Beycan; CheckedBy: Mustafa Atılay Beycan; Author: Mustafa Atılay Beycan; CompanyName: Mustafa Atılay Beycan; DrawnBy: Mustafa Atılay Beycan; Engineer: Mustafa Atılay Beycan; Organization: Mustafa Atılay Beycan; SheetNumber: 5; SheetTotal: 8; FilePath: https://github.com/mustafaatilay/Outdoor-Tracking-Project
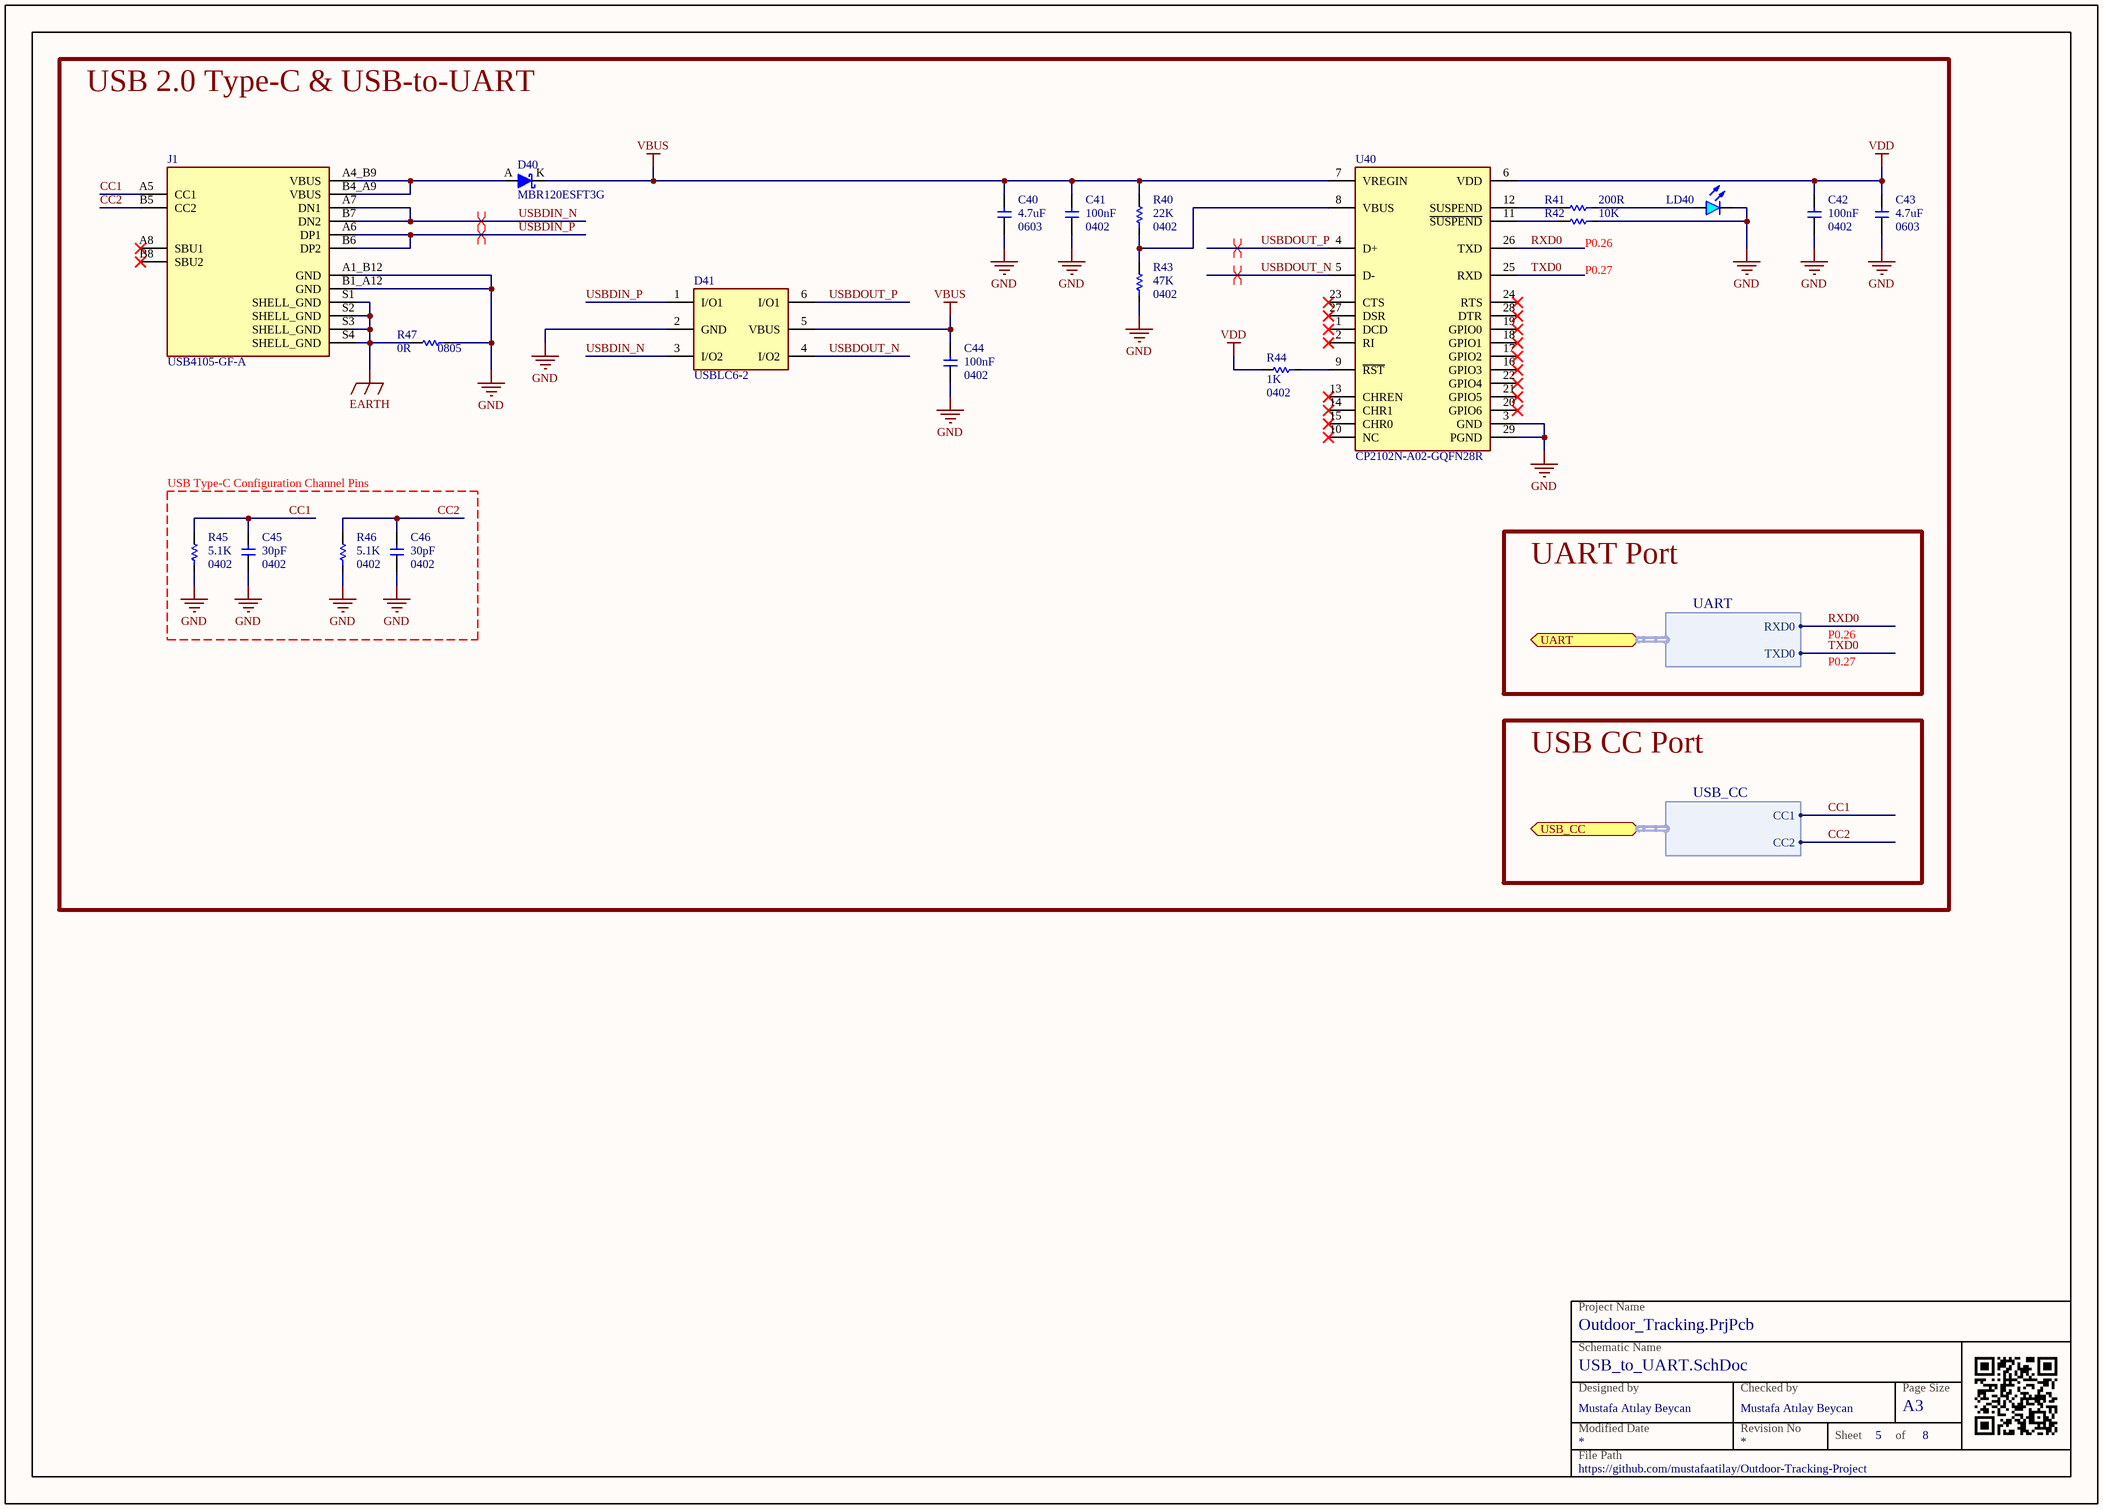
[diagram p4: USB_to_UART.SchDoc]

### Parts
C40  Capacitance: 4.7uF  Package: 0603  [CAP 0603]  (hidden comment: 4.7uF 10% X7R 16V 0603 SMD)
C41  Capacitance: 100nF  Package: 0402  [CAP 0402]  (hidden comment: 100nF 10% X7R 10V 0402 SMD)
C42  Capacitance: 100nF  Package: 0402  [CAP 0402]  (hidden comment: 100nF 10% X7R 10V 0402 SMD)
C43  Capacitance: 4.7uF  Package: 0603  [CAP 0603]  (hidden comment: 4.7uF 10% X7R 16V 0603 SMD)
C44  Capacitance: 100nF  Package: 0402  [CAP 0402]  (hidden comment: 100nF 10% X7R 16V 0402 SMD)
C45  Capacitance: 30pF  Package: 0402  [CAP 0402]  (hidden comment: 30pF 5% C0G/NP0 50V 0402 SMD)
C46  Capacitance: 30pF  Package: 0402  [CAP 0402]  (hidden comment: 30pF 5% C0G/NP0 50V 0402 SMD)
D40  MBR120ESFT3G  [DIODE SOD-123]
D41  USBLC6-2  [IC SOT23-6]
J1  USB4105-GF-A  [CONN USB TYPE-C USB4105-GF-A]
LD40  LED SMD  [LED 0603 BLUE]  (value not drawn)
R40  Resistance: 22K  Package: 0402  [RES 0402]  (hidden comment: 22K 1% 1/10W 0402 SMD)
R41  Resistance: 200R  [RES 0402]  (hidden comment: 200R 5% 1/10W 0402 SMD)
R42  Resistance: 10K  [RES 0402]  (hidden comment: 10K 5% 1/10W 0402 SMD)
R43  Resistance: 47K  Package: 0402  [RES 0402]  (hidden comment: 47K 1% 1/10W 0402 SMD)
R44  Resistance: 1K  Package: 0402  [RES 0402]  (hidden comment: 1K 5% 1/10W 0402 SMD)
R45  Resistance: 5.1K  Package: 0402  [RES 0402]  (hidden comment: RES 0402)
R46  Resistance: 5.1K  Package: 0402  [RES 0402]  (hidden comment: RES 0402)
R47  Resistance: 0R  Package: 0805  [RES 0805]  (hidden comment: 0R 5% * 0805 SMD)
U40  CP2102N-A02-GQFN28R  [IC QFN-28 (5x5)]

### Blocks framed on the sheet
USB Type-C Configuration Channel Pins: C45 C46 R45 R46

### Ports
UART (bidir, harness UART), USB_CC (bidir, harness USB_CC)

### Harnesses
UART: RXD0, TXD0
USB_CC: CC1, CC2

### Nets
EARTH: J1.S1(SHELL_GND) J1.S2(SHELL_GND) J1.S3(SHELL_GND) J1.S4(SHELL_GND) R47.2
GND: C40.2 C41.2 C42.2 C43.2 C44.2 C45.2 C46.2 D41.2(GND) J1.A1_B12(GND) J1.B1_A12(GND) LD40.K R42.1 R43.1 R45.1 R46.1 R47.1 U40.3(GND) U40.29(PGND)
VBUS: C40.1 C41.1 C44.1 D40.K D41.5(VBUS) R40.2 U40.7(VREGIN)
VDD: C42.1 C43.1 R44.2 U40.6(VDD)
CC1: C45.1 J1.A5(CC1) R45.2 ; port USB_CC.CC1
CC2: C46.1 J1.B5(CC2) R46.2 ; port USB_CC.CC2
RXD0: U40.26(TXD) ; port UART.RXD0
TXD0: U40.25(RXD) ; port UART.TXD0
USBDIN_N: D41.3(I/O2) J1.A7(DN1) J1.B7(DN2)
USBDIN_P: D41.1(I/O1) J1.A6(DP1) J1.B6(DP2)
USBDOUT_N: D41.4(I/O2) U40.5(D-)
USBDOUT_P: D41.6(I/O1) U40.4(D+)
NetD40_A: D40.A J1.A4_B9(VBUS) J1.B4_A9(VBUS)
NetLD40_A: LD40.A R41.1
NetR40_1: R40.1 R43.2 U40.8(VBUS)
NetR41_2: R41.2 U40.12(SUSPEND)
NetR42_2: R42.2 U40.11(~{SUSPEND})
NetR44_1: R44.1 U40.9(~{RST})

Not connected (* = marked no-connect by the designer): J1 A8(SBU1)* B8(SBU2)*; U40 1(DCD)* 2(RI)* 10(NC)* 13(CHREN)* 14(CHR1)* 15(CHR0)* 16(GPIO3)* 17(GPIO2)* 18(GPIO1)* 19(GPIO0)* 20(GPIO6)* 21(GPIO5)* 22(GPIO4)* 23(CTS)* 24(RTS)* 27(DSR)* 28(DTR)*

### Layout directives
differential pair: USBDIN_N, USBDIN_P, USBDOUT_N, USBDOUT_P

### Notes on the sheet
- USB 2.0 Type-C & USB-to-UART
- (near R42) P0.26
- P0.27
- UART Port
- P0.26
- USB CC Port
- Project Name
- Designed by
- Schematic Name
- Checked by
- Page Size
- File Path
- Modified Date
- Revision No
- Sheet
- of
- A3

### Library data of the parts
C40 C43 = CAP 0603 4.7uF 16V: ALT MALZEME KODU: 1.009.01147; Link: *; Manufacturer: *; Manufacturer Part Number: *; Value: 4.7uF 10% X7R 16V 0603 SMD; Tolerance: 10%; TemperatureCoefficient: X7R; Mount: SMD; Voltage: 16V
C41 C42 = CAP 0402 100nF 10V: ALT MALZEME KODU: 1.009.00840; Link: *; Manufacturer: *; Manufacturer Part Number: *; Value: 100nF 10% X7R 10V 0402 SMD; Tolerance: 10%; TemperatureCoefficient: X7R; Mount: SMD; Voltage: 10V
C44 = CAP 0402 100nF 16V: ALT MALZEME KODU: 1.009.00275; Link: *; Manufacturer: *; Manufacturer Part Number: *; Value: 100nF 10% X7R 16V 0402 SMD; Tolerance: 10%; TemperatureCoefficient: X7R; Mount: SMD; Voltage: 16V
C45 C46 = CAP 0402 30pF 50V: Link: *; Manufacturer: *; Manufacturer Part Number: *; Value: 30pF 5% C0G/NP0 50V 0402 SMD; Tolerance: 5%; TemperatureCoefficient: C0G/NP0; Mount: SMD; ALT MALZEME KODU: *; Voltage: 50V
D40 = DIODE MBR120ESFT3G: DIODE SCHOTTKY 20V 1A SOD123FL; Manufacturer: ON Semiconductor; Voltage - Forward: 530mV @ 1A; ALT MALZEME KODU: 1.012.00347; Link: https://bit.ly/37E0dBG; Manufacturer Part Number: MBR120ESFT3G; Mount: SMD; Current-Rectified: 1A; Package: SOD-123; Voltage - DC Reverse: 20V
D41 = DIODE USBLC6-2 TVS: TVS DIODE 5.25VWM 17VC SOT23-6; Manufacturer: STMicroelectronics; Manufacturer Part Number: USBLC6-2SC6; Direction: Unidirectional,Bidirectional; Clamping Voltage: 17V; Number of Bidirectional Channels: 2; Reverse Standoff Voltage: 5.25V; Min Breakdown Voltage: 6V; Power Line Protection: Yes; Leakage Current: 150nA; Peak Pulse Current: 5A; Capacitance: 3.5pF; Operating Supply Voltage: 1.1V; Working Voltage: 5V; Test Current: 1mA; Number of Elements: 1; Element Configuration: Dual; Data Rate: 480Mbps; Link: https://bit.ly/3zN9Iyf; Link 2: https://bit.ly/3tGO0rO; ALT MALZEME KODU: *; Supplier 1: Digi-Key; RoHS: Yes; Category: TVS Diodes; Pricing 1: 1=0,63000, 10=0,54200, 100=0,40440, 500=0,31774, 1000=0,24553 (USD); Mount: Surface Mount; Case/Package: SOT-23; Number of Pins: 6; Contact Plating: Tin,Matte; Min Operating Temperature: -40°C; Max Operating Temperature: 125°C; Packaging: Tape and Reel; Series: USB; Package Quantity: 3000; Breakdown Voltage: 6V; Number of Channels: 2; Polarity: Unidirectional,Bidirectional; Termination: SMD/SMT; ESD Protection: Yes; Max Reverse Leakage Current: 150nA; Reverse Breakdown Voltage: 6V; Max Breakdown Voltage: 6V; Clamping Voltage-Max: 17V; Length: 3.05mm; Width: 1.75mm; Height: 1.3mm; Depth: 1.75mm; Radiation Hardening: No; RoHS Compliant: Yes; Lead Free: Lead Free; REACH SVHC: No SVHC; ComponentLink1URL: https://datasheet.ciiva.com/1268/1690354-1268384.pdf?src-supplier=Element14; ComponentLink1Description: https://datasheet.ciiva.com/1268/1690354-1268384.pdf?src-supplier=Element14; ComponentLink2URL: https://datasheet.ciiva.com/4508/cd00050750-113117-4508433.pdf?src-supplier=Mouser; ComponentLink2Description: https://datasheet.ciiva.com/4508/cd00050750-113117-4508433.pdf?src-supplier=Mouser; ComponentLink3URL: https://datasheet.ciiva.com/15143/getdatasheetpartid-148465-15143789.pdf?src-supplier=Verical; ComponentLink3Description: https://datasheet.ciiva.com/15143/getdatasheetpartid-148465-15143789.pdf?src-supplier=Verical; ComponentLink4URL: https://datasheet.ciiva.com/16200/cd00050750-16200026.pdf?src-supplier=Future+Electronics; ComponentLink4Description: https://datasheet.ciiva.com/16200/cd00050750-16200026.pdf?src-supplier=Future+Electronics; ComponentLink5URL: https://datasheet.ciiva.com/41444/001184109-da-01-en-ic-esd-protecti-usblc6-2sc6-sot-23-6-stm-41444156.pdf?src-supplier=Conrad; ComponentLink5Description: https://datasheet.ciiva.com/41444/001184109-da-01-en-ic-esd-protecti-usblc6-2sc6-sot-23-6-stm-41444156.pdf?src-supplier=Conrad; Supplier Part Number 1: 497-5235-6-ND
J1 = CONN USB TYPE-C USB4105-GF-A: CONN RCP USB2.0 TYP C 24P SMD RA; ALT MALZEME KODU: 1.010.01014; MF: {'manufacturer': u'GCT'}; Link: https://bit.ly/3MQbJhe; MP: USB4105-GF-A; Value: *; Price: None
LD40 = LED SMD BLUE_0603: LED SMD 0603 BLUE; Link: *; ALT MALZEME KODU: *; Color: BLUE; Package: 0603
R40 = RES 0402 22K 1%: ALT MALZEME KODU: 1.031.00871; Link: *; Manufacturer: *; Manufacturer Part Number: *; Value: 22K 1% 1/10W 0402 SMD; Tolerance: 1%; PowerRating: 1/10W; Mount: SMD
R41 = RES 0402 200R 5%: ALT MALZEME KODU: 1.031.00643; Link: *; Manufacturer: *; Manufacturer Part Number: *; Value: 200R 5% 1/10W 0402 SMD; PowerRating: 1/10W; Mount: SMD; Tolerance: 5%; Package: 0402
R42 = RES 0402 10K 5%: ALT MALZEME KODU: 1.031.00615; Link: *; Manufacturer: *; Manufacturer Part Number: *; Value: 10K 5% 1/10W 0402 SMD; Tolerance: 5%; PowerRating: 1/10W; Mount: SMD; Package: 0402
R43 = RES 0402 47K 1%: ALT MALZEME KODU: 1.031.00696; Link: *; Manufacturer: *; Manufacturer Part Number: *; Value: 47K 1% 1/10W 0402 SMD; PowerRating: 1/10W; Mount: SMD; Tolerance: 1%
R44 = RES 0402 1K 5%: ALT MALZEME KODU: 1.031.00622; Link: *; Manufacturer: *; Manufacturer Part Number: *; Value: 1K 5% 1/10W 0402 SMD; PowerRating: 1/10W; Mount: SMD; Tolerance: 5%
R45 R46 = RES 0402: Tolerance: 10%; PowerRating: 1/10W; Link: *; Manufacturer: *; Manufacturer Part Number: *; Value: RES 0402; Mount: SMD; ALT MALZEME KODU: *
R47 = RES 0805 0R 5%: ALT MALZEME KODU: 1.031.00613; Link: *; Manufacturer: *; Manufacturer Part Number: *; Value: 0R 5% * 0805 SMD; Tolerance: 5%; PowerRating: *; Mount: SMD
U40 = IC CP2102N-A02-GQFN28R: IC USB TO UART BRIDGE QFN28; Manufacturer: Silicon Labs; Protocol: USB 2.0; Voltage - Supply: 3.3V ~ 5.25V; Current - Supply: 15mA; ALT MALZEME KODU: 1.020.01045; Manufacturer Part Number: CP2102N-A02-GQFN28R; Link: https://bit.ly/2YGeVUM; Interface: UART; Mount: SMD; Package: 28-SSOP

## Sheet Peripheral.SchDoc
size A3; ApprovedBy: Mustafa Atılay Beycan; CheckedBy: Mustafa Atılay Beycan; Author: Mustafa Atılay Beycan; CompanyName: Mustafa Atılay Beycan; DrawnBy: Mustafa Atılay Beycan; Engineer: Mustafa Atılay Beycan; Organization: Mustafa Atılay Beycan; SheetNumber: 8; SheetTotal: 8; FilePath: https://github.com/mustafaatilay/Outdoor-Tracking-Project
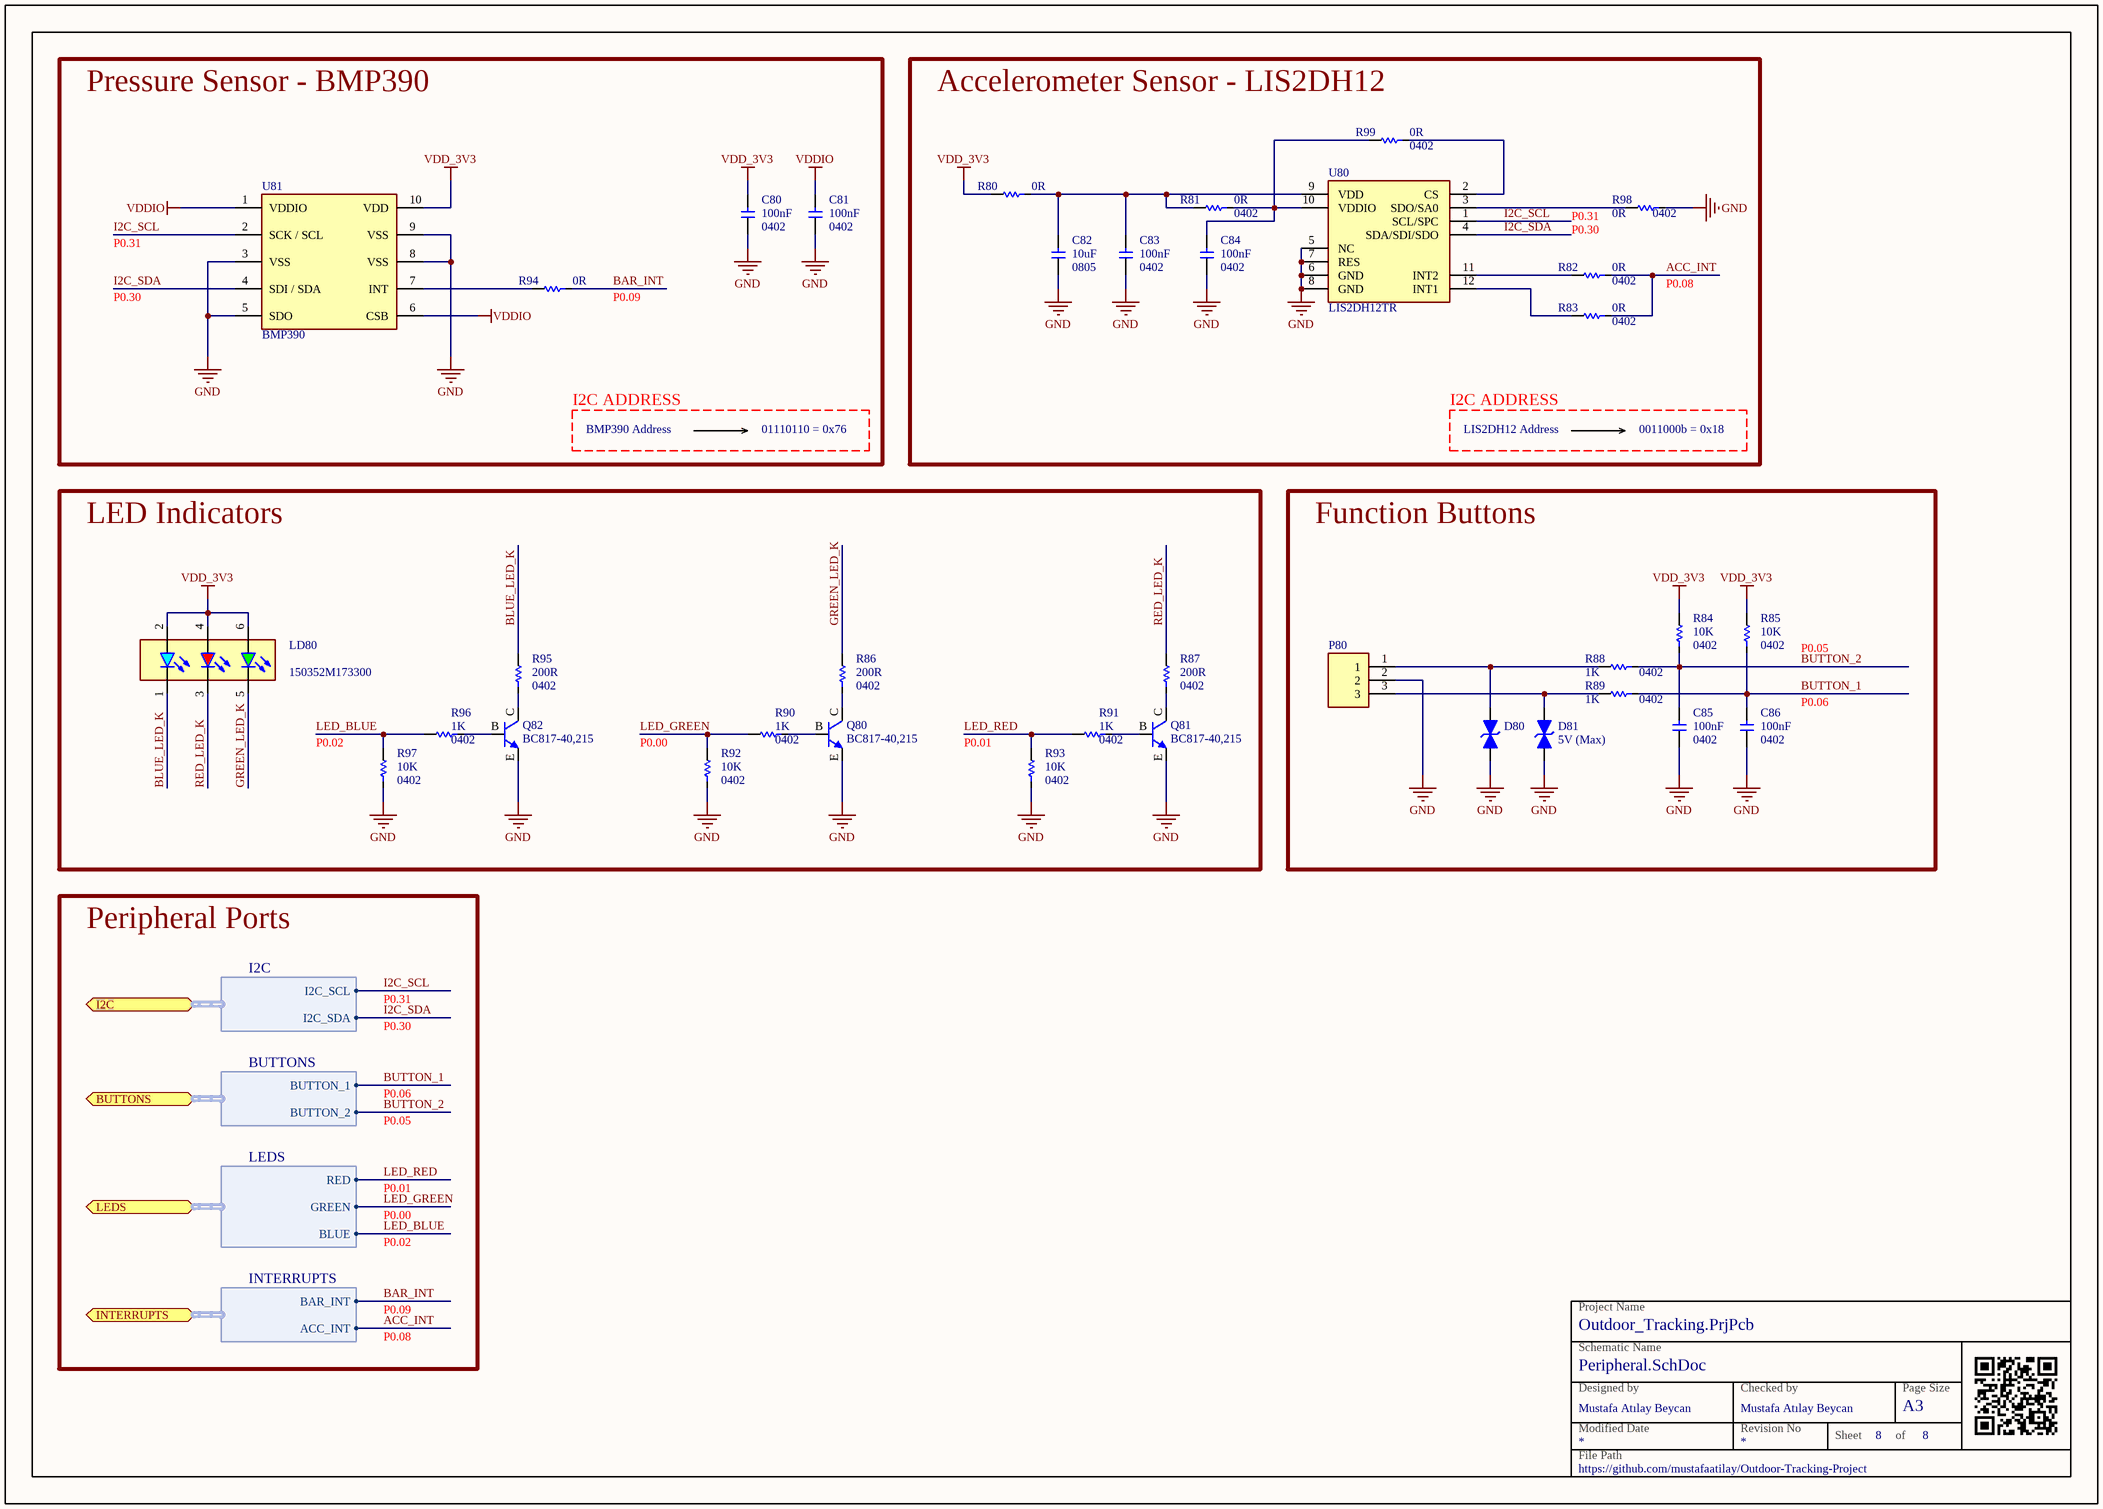
[diagram p5: Peripheral.SchDoc]

### Parts
C80  Capacitance: 100nF  Package: 0402  [CAP 0402]  (hidden comment: 100nF 10% X7R 16V 0402 SMD)
C81  Capacitance: 100nF  Package: 0402  [CAP 0402]  (hidden comment: 100nF 10% X7R 16V 0402 SMD)
C82  Capacitance: 10uF  Package: 0805  [CAP 0805]  (hidden comment: 10uF 10% X7R 10V 0805 SMD)
C83  Capacitance: 100nF  Package: 0402  [CAP 0402]  (hidden comment: 100nF 10% X7R 10V 0402 SMD)
C84  Capacitance: 100nF  Package: 0402  [CAP 0402]  (hidden comment: 100nF 10% X7R 10V 0402 SMD)
C85  Capacitance: 100nF  Package: 0402  [CAP 0402]  (hidden comment: 100nF 10% X7R 16V 0402 SMD)
C86  Capacitance: 100nF  Package: 0402  [CAP 0402]  (hidden comment: 100nF 10% X7R 16V 0402 SMD)
D80  D5V0L1B2LP4-7B  [DIODE 0402]  (value not drawn)
D81  Voltage - Reverse Standoff (Typ): 5V (Max)  [DIODE 0402]  (hidden comment: D5V0L1B2LP4-7B)
LD80  150352M173300  [LED RGB 150352M173300]
P80  HEADER 1 X 3 RA  [HDR 1X3 RA]  (value not drawn)
Q80  BC817-40,215  [TRAN SOT-23-3]
Q81  BC817-40,215  [TRAN SOT-23-3]
Q82  BC817-40,215  [TRAN SOT-23-3]
R80  Resistance: 0R  [RES 0402]  (hidden comment: 0R 5% * 0402 SMD)
R81  Resistance: 0R  Package: 0402  [RES 0402]  (hidden comment: 0R 5% * 0402 SMD)
R82  Resistance: 0R  Package: 0402  [RES 0402]  (hidden comment: 0R 5% * 0402 SMD)
R83  Resistance: 0R  Package: 0402  [RES 0402]  (hidden comment: 0R 5% * 0402 SMD)
R84  Resistance: 10K  Package: 0402  [RES 0402]  (hidden comment: 10K 5% 1/10W 0402 SMD)
R85  Resistance: 10K  Package: 0402  [RES 0402]  (hidden comment: 10K 5% 1/10W 0402 SMD)
R86  Resistance: 200R  Package: 0402  [RES 0402]  (hidden comment: 200R 5% 1/10W 0402 SMD)
R87  Resistance: 200R  Package: 0402  [RES 0402]  (hidden comment: 200R 5% 1/10W 0402 SMD)
R88  Resistance: 1K  Package: 0402  [RES 0402]  (hidden comment: 1K 5% 1/10W 0402 SMD)
R89  Resistance: 1K  Package: 0402  [RES 0402]  (hidden comment: 1K 5% 1/10W 0402 SMD)
R90  Resistance: 1K  Package: 0402  [RES 0402]  (hidden comment: 1K 5% 1/10W 0402 SMD)
R91  Resistance: 1K  Package: 0402  [RES 0402]  (hidden comment: 1K 5% 1/10W 0402 SMD)
R92  Resistance: 10K  Package: 0402  [RES 0402]  (hidden comment: 10K 5% 1/10W 0402 SMD)
R93  Resistance: 10K  Package: 0402  [RES 0402]  (hidden comment: 10K 5% 1/10W 0402 SMD)
R94  Resistance: 0R  [RES 0402]  (hidden comment: 0R 5% * 0402 SMD)
R95  Resistance: 200R  Package: 0402  [RES 0402]  (hidden comment: 200R 5% 1/10W 0402 SMD)
R96  Resistance: 1K  Package: 0402  [RES 0402]  (hidden comment: 1K 5% 1/10W 0402 SMD)
R97  Resistance: 10K  Package: 0402  [RES 0402]  (hidden comment: 10K 5% 1/10W 0402 SMD)
R98  Resistance: 0R  Package: 0402  [RES 0402]  (hidden comment: 0R 5% * 0402 SMD)
R99  Resistance: 0R  Package: 0402  [RES 0402]  (hidden comment: 0R 5% * 0402 SMD)
U80  LIS2DH12TR  [IC LGA-12 (2x2)]
U81  BMP390  [IC LGA-10 (2X2)]

### Blocks framed on the sheet
Pressure Sensor - BMP390: C80 C81 R94 U81
Accelerometer Sensor - LIS2DH12: C82-C84 R80-R83 R98 R99 U80
LED Indicators: LD80 Q80-Q82 R86 R87 R90-R93 R95-R97
Function Buttons: C85 C86 D80 D81 P80 R84 R85 R88 R89

### Ports
BUTTONS (bidir, harness BUTTONS), I2C (bidir, harness I2C), INTERRUPTS (bidir, harness INTERRUPTS), LEDS (bidir, harness LEDS)

### Harnesses
I2C: I2C_SCL, I2C_SDA
BUTTONS: BUTTON_1, BUTTON_2
LEDS: RED, GREEN, BLUE
INTERRUPTS: BAR_INT, ACC_INT

### Nets
GND: C80.2 C81.2 C82.2 C83.2 C84.2 C85.2 C86.2 D80.2 D81.2 P80.2 Q80.E Q81.E Q82.E R92.1 R93.1 R97.1 R98.1 U80.5(NC) U80.6(GND) U80.7(RES) U80.8(GND) U81.3(VSS) U81.5(SDO) U81.8(VSS) U81.9(VSS)
VDD_3V3: C80.1 LD80.2(A) LD80.4(A) LD80.6(A) R80.2 R84.2 R85.2 U81.10(VDD)
VDDIO: C81.1 U81.1(VDDIO) U81.6(CSB)
ACC_INT: R82.1 R83.1 ; port INTERRUPTS.ACC_INT
BAR_INT: R94.1 ; port INTERRUPTS.BAR_INT
BLUE_LED_K: LD80.1(K) R95.2
BUTTON_1: C86.1 R85.1 R89.1 ; port BUTTONS.BUTTON_1
BUTTON_2: C85.1 R84.1 R88.1 ; port BUTTONS.BUTTON_2
GREEN_LED_K: LD80.5(K) R86.2
I2C_SCL: U80.1(SCL/SPC) U81.2(SCK_/_SCL) ; port I2C.I2C_SCL
I2C_SDA: U80.4(SDA/SDI/SDO) U81.4(SDI_/_SDA) ; port I2C.I2C_SDA
LED_BLUE: R96.2 R97.2 ; port LEDS.BLUE
LED_GREEN: R90.2 R92.2 ; port LEDS.GREEN
LED_RED: R91.2 R93.2 ; port LEDS.RED
RED_LED_K: LD80.3(K) R87.2
NetC82_1: C82.1 C83.1 R80.1 R81.2 U80.9(VDD)
NetC84_1: C84.1 R81.1 R99.2 U80.10(VDDIO)
NetD80_1: D80.1 P80.1 R88.2
NetD81_1: D81.1 P80.3 R89.2
NetQ80_B: Q80.B R90.1
NetQ80_C: Q80.C R86.1
NetQ81_B: Q81.B R91.1
NetQ81_C: Q81.C R87.1
NetQ82_B: Q82.B R96.1
NetQ82_C: Q82.C R95.1
NetR82_2: R82.2 U80.11(INT2)
NetR83_2: R83.2 U80.12(INT1)
NetR94_2: R94.2 U81.7(INT)
NetR98_2: R98.2 U80.3(SDO/SA0)
NetR99_1: R99.1 U80.2(CS)

### Notes on the sheet
- P0.31
- P0.30
- (near R98) P0.31
- (near R94) P0.09
- P0.08
- I2C ADDRESS
- BMP390 Address
- 01110110 = 0x76
- LIS2DH12 Address
- 0011000b = 0x18
- P0.05
- P0.06
- (near R97) P0.02
- (near R92) P0.00
- (near R93) P0.01
- Peripheral Ports
- P0.01
- P0.00
- P0.02
- P0.09
- Project Name
- Designed by
- Schematic Name
- Checked by
- Page Size
- File Path
- Modified Date
- Revision No
- Sheet
- of
- A3

### Library data of the parts
C80 C81 C85 C86 = CAP 0402 100nF 16V: ALT MALZEME KODU: 1.009.00275; Link: *; Manufacturer: *; Manufacturer Part Number: *; Value: 100nF 10% X7R 16V 0402 SMD; Tolerance: 10%; TemperatureCoefficient: X7R; Mount: SMD; Voltage: 16V
C82 = CAP 0805 10uF 10V: ALT MALZEME KODU: 1.009.00295; Link: *; Manufacturer: *; Manufacturer Part Number: *; Value: 10uF 10% X7R 10V 0805 SMD; Tolerance: 10%; TemperatureCoefficient: X7R; Mount: SMD; Voltage: 10V
C83 C84 = CAP 0402 100nF 10V: ALT MALZEME KODU: 1.009.00840; Link: *; Manufacturer: *; Manufacturer Part Number: *; Value: 100nF 10% X7R 10V 0402 SMD; Tolerance: 10%; TemperatureCoefficient: X7R; Mount: SMD; Voltage: 10V
D80 = TVS D5V0L1B2LP4-7B: TVS DIODE 5VWM 14VC DFN1006-2; Manufacturer: Diodes Incorporated; Manufacturer Part Number: D5V0L1B2WS-7; Capacitance @ Frequency: 15pF @ 1MHz; Power Line Protection: No; Power - Peak Pulse: 84W; Current - Peak Pulse (10/1000µs): 6A (8/20µs); Voltage - Clamping (Max) @ Ipp: 14V; Voltage - Breakdown (Min): 6V; Bidirectional Channels: 1; Type: Zener; Voltage - Reverse Standoff (Typ): 5V (Max); Link: https://bit.ly/3Wt3y1t; ALT MALZEME KODU: *; Package: 0402; Mount: SMD
D81 = TVS D5V0L1B2LP4-7B: TVS DIODE 5VWM 14VC DFN1006-2; Manufacturer: Diodes Incorporated; Manufacturer Part Number: D5V0L1B2WS-7; Capacitance @ Frequency: 15pF @ 1MHz; Power Line Protection: No; Power - Peak Pulse: 84W; Current - Peak Pulse (10/1000µs): 6A (8/20µs); Voltage - Clamping (Max) @ Ipp: 14V; Voltage - Breakdown (Min): 6V; Bidirectional Channels: 1; Type: Zener; Link: https://bit.ly/3Wt3y1t; ALT MALZEME KODU: *; Package: 0402; Mount: SMD
LD80 = LED RGB 150352M173300: as LD20 on sheet Power_Management; Manufacturer Product Number: 150352M173300; Link: https://bit.ly/4dLumjj
P80 = HEADER 1 X 3 RA: CONN HEADER 1 X 3 RA; ALT MALZEME KODU: 1.010.01029; Link: *; Manufacturer: *; Manufacturer Part Number: *; Mount: Through Hole
Q80-Q82 = NPN BC817-40,215: TRANS NPN 45V 0.5A SOT23; Manufacturer: Nexperia USA Inc.; Current - Collector: 500mA; Power: 250mW; Vce Saturation (Max) @ Ib, Ic: 700mV @ 50mA, 500mA; Voltage - Collector Emitter Breakdown: 45V (Max); ALT MALZEME KODU: 1.036.01085; Link: https://bit.ly/3mIUS1M; Manufacturer Part Number: BC817-40,215; Mount: SMD; Transistor Type: NPN; Package: SOT-23-3
R80-R83 R94 R98 R99 = RES 0402 0R 5%: ALT MALZEME KODU: 1.031.00612; Link: *; Manufacturer: *; Manufacturer Part Number: *; Value: 0R 5% * 0402 SMD; Tolerance: 5%; PowerRating: *; Mount: SMD
  R80 R94: Package: 0402
R84 R85 R92 R93 R97 = RES 0402 10K 5%: ALT MALZEME KODU: 1.031.00615; Link: *; Manufacturer: *; Manufacturer Part Number: *; Value: 10K 5% 1/10W 0402 SMD; Tolerance: 5%; PowerRating: 1/10W; Mount: SMD
R86 R87 R95 = RES 0402 200R 5%: ALT MALZEME KODU: 1.031.00643; Link: *; Manufacturer: *; Manufacturer Part Number: *; Value: 200R 5% 1/10W 0402 SMD; PowerRating: 1/10W; Mount: SMD; Tolerance: 5%
R88-R91 R96 = RES 0402 1K 5%: ALT MALZEME KODU: 1.031.00622; Link: *; Manufacturer: *; Manufacturer Part Number: *; Value: 1K 5% 1/10W 0402 SMD; PowerRating: 1/10W; Mount: SMD; Tolerance: 5%
U80 = IC LIS2DH12TR: ACCELEROMETER MEMS 3 AXIS 16G; Manufacturer: STMicroelectronics; Min Supply Voltage: 1.71V; Max Supply Voltage: 3.6V; Bandwidth: 672Hz; Interface: I2C,SPI; Output Type: SPI,I2C,Digital; Axis: X, Y, Z; Supplier 1: Digi-Key; Manufacturer Part Number: LIS2DH12TR; RoHS: Yes; Category: Accelerometers; Mount: Surface Mount; Case/Package: LGA; Number of Pins: 12; Contact Plating: Gold; Min Operating Temperature: -40°C; Max Operating Temperature: 85°C; Packaging: Cut Tape; Length: 2.15mm; Width: 2.15mm; Height: 1mm; Radiation Hardening: No; REACH SVHC: No SVHC; Lead Free: Lead Free; RoHS Compliant: Yes; ComponentLink1URL: https://datasheet.ciiva.com/46423/1836729-46423946.pdf?src-supplier=Element14; ComponentLink1Description: https://datasheet.ciiva.com/46423/1836729-46423946.pdf?src-supplier=Element14; Link: https://bit.ly/3goFJVF; Supplier Part Number 1: 497-14851-1-ND; ALT MALZEME KODU: *
U81 = IC BMP390: SENSOR 18.13PSIA 10LGA; Manufacturer: Bosch Sensortec; Pressure Type: Absolute; Operating Pressure: 4.35PSI ~ 18.13PSI (30kPa ~ 125kPa); Output Type: I2C, SPI; Accuracy: ±0.01PSI (0.05kPa); Voltage - Supply: 1.65V ~ 3.6V; Maximum Pressure: 290.08PSI (2000kPa); Link: https://bit.ly/4bnh8aY